# EAGLE design RCMx1 Rev_02 (EAGLE 6.5.0)
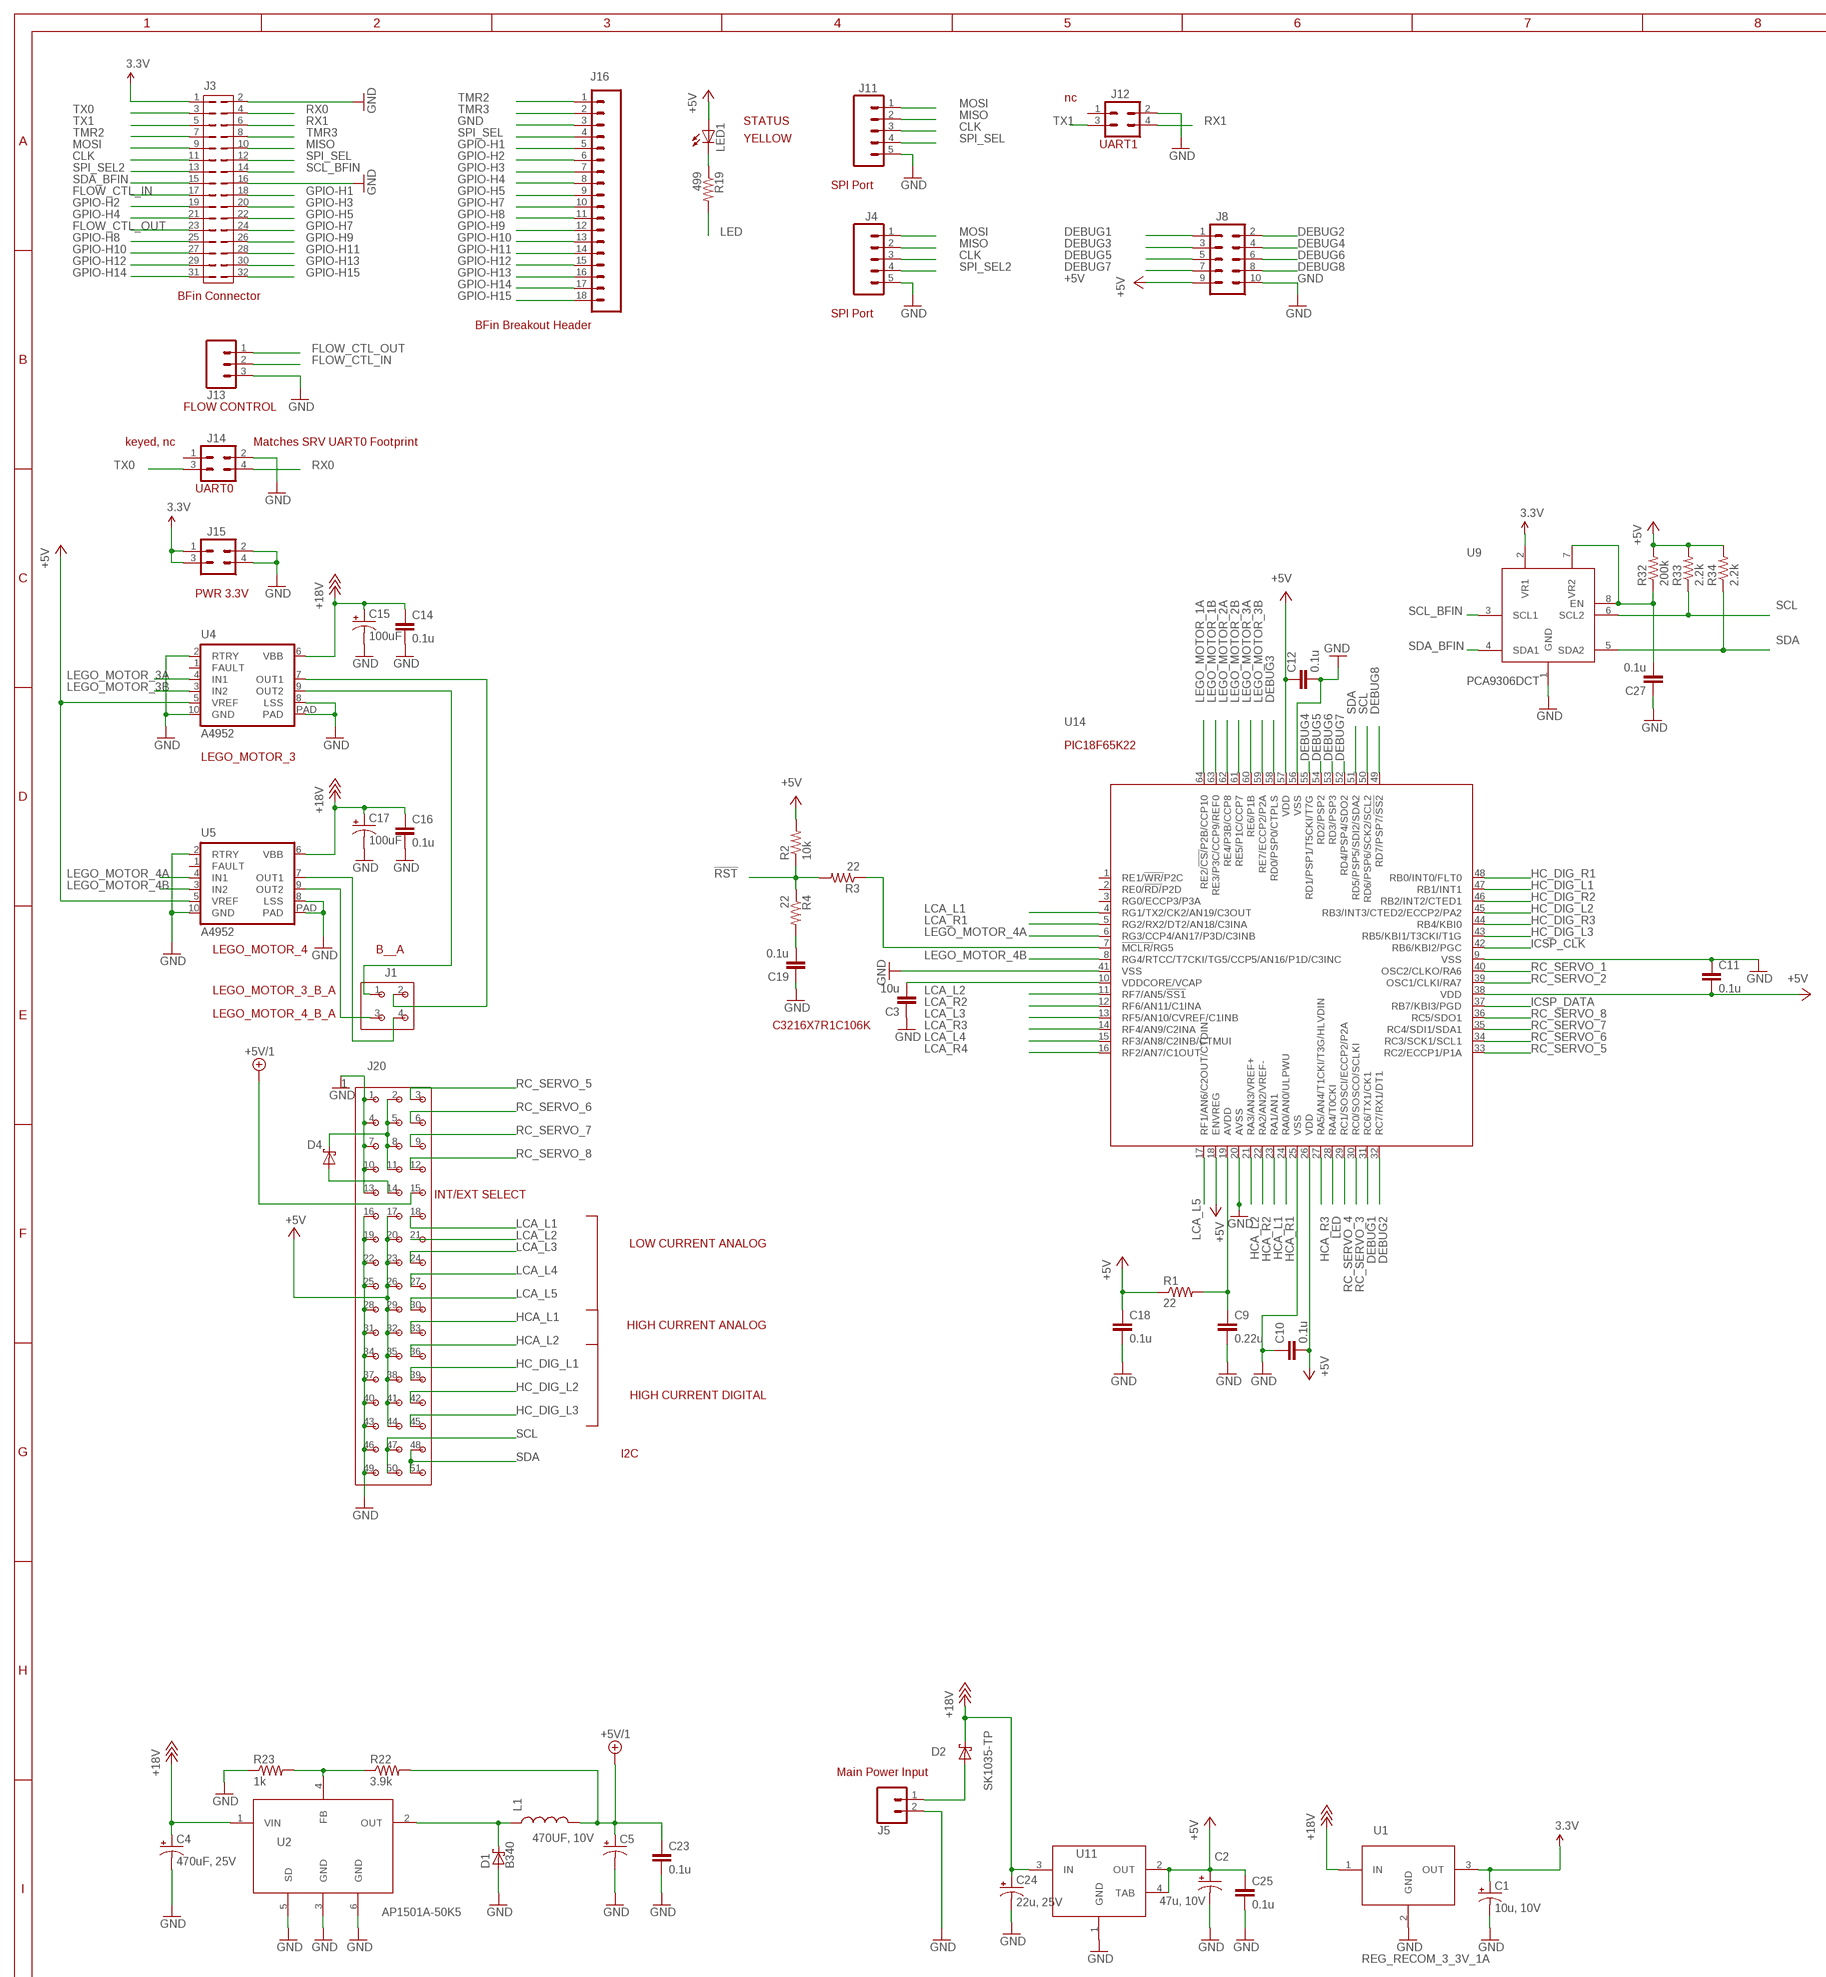
[diagram p0: schematic, sheet 1, part 1 of 2]
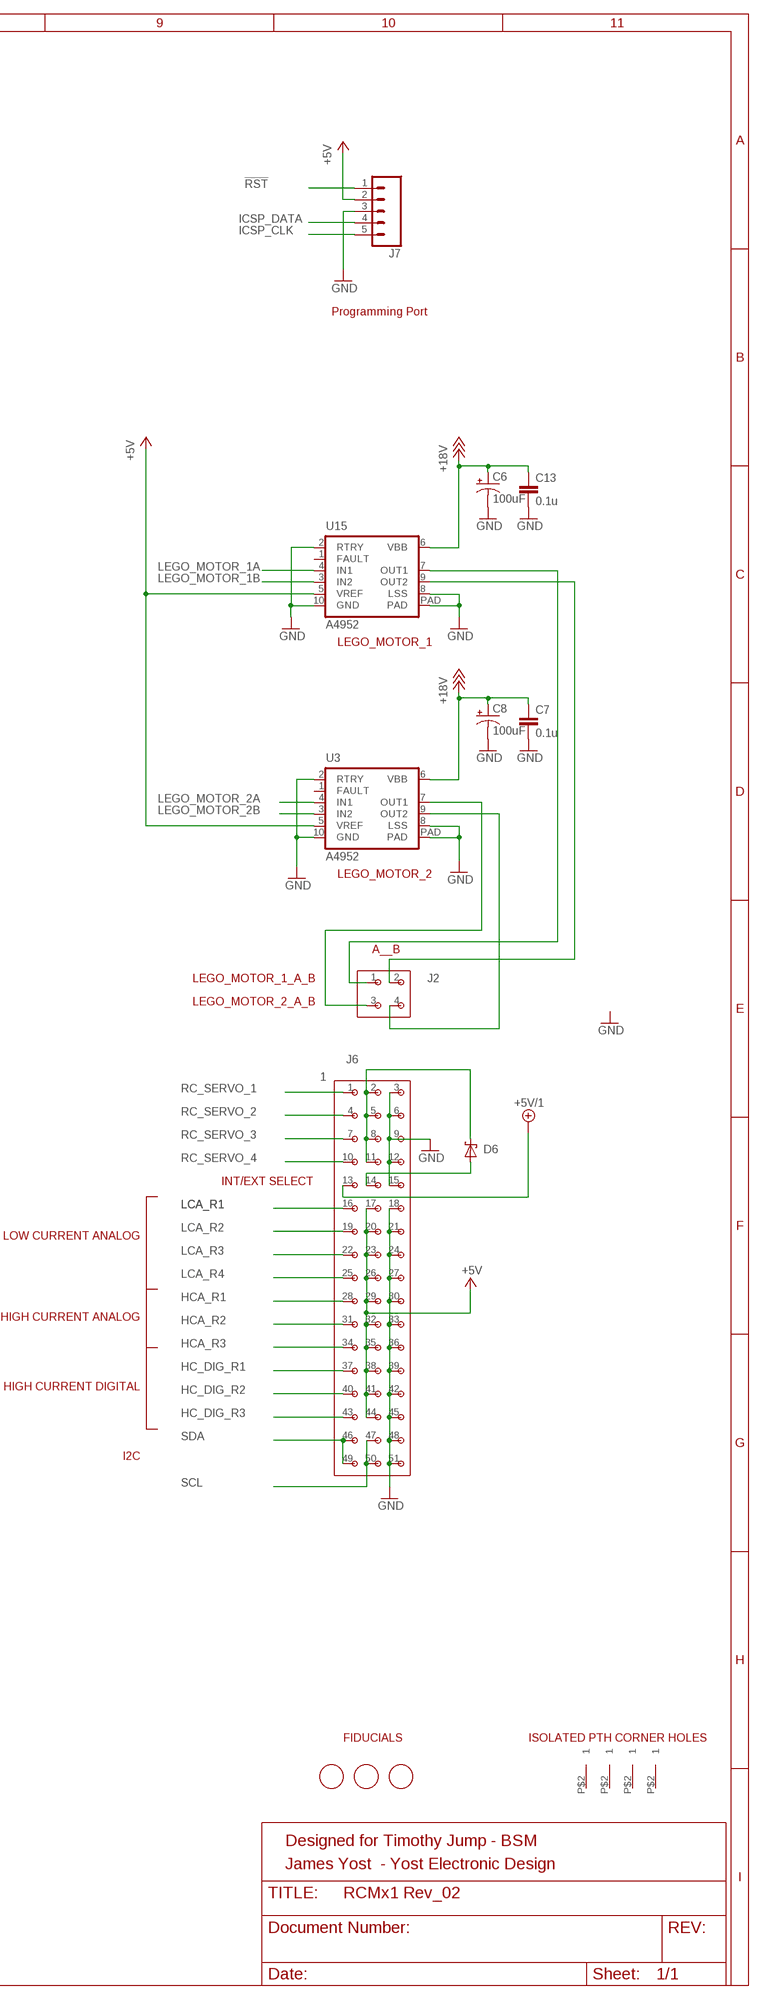
[diagram p1: schematic, sheet 1, part 2 of 2]

## Parts
C1  10u, 10V  CAP_POL1206  [EIA3216]
C2  47u, 10V  CAP_1210_POL  [CAP1210_POL]
C3  10u  CAP1206  [1206]
C4  470uF, 25V  CAP_POLG  [PANASONIC_G]
C5  470UF, 10V  CAP_ELT_PANASONIC_470UF  [PANASONIC_F]
C6  100uF  CAP_POLD  [PANASONIC_D]
C7  0.1u  CAP0805  [0805]
C8  100uF  CAP_POLD  [PANASONIC_D]
C9  0.22u  CAP0805  [0805]
C10  0.1u  CAP0805  [0805]
C11  0.1u  CAP0805  [0805]
C12  0.1u  CAP0805  [0805]
C13  0.1u  CAP0805  [0805]
C14  0.1u  CAP0805  [0805]
C15  100uF  CAP_POLD  [PANASONIC_D]
C16  0.1u  CAP0805  [0805]
C17  100uF  CAP_POLD  [PANASONIC_D]
C18  0.1u  CAP0805  [0805]
C19  0.1u  CAP0805  [0805]
C23  0.1u  CAP0805  [0805]
C24  22u, 25V  CAP_1210_POL  [CAP1210_POL]
C25  0.1u  CAP0805  [0805]
C27  0.1u  CAP0805  [0805]
D1  B340  [SMA_DO214AC]
D2  SK1035-TP  [DO214AB]
D4  SK1035-TP  [DO214AB]
D6  SK1035-TP  [DO214AB]
FID1  FIDUCIAL  [FIDUCIAL_1MM]
FID2  FIDUCIAL  [FIDUCIAL_1MM]
FID3  FIDUCIAL  [FIDUCIAL_1MM]
J1  CON_2X2_0_100  [CON_2X2_0_100]
J2  CON_2X2_0_100  [CON_2X2_0_100]
J3  CON_2X16_0_100  [CON_2X16_0_100]
J4  M05PTH  [1X05]
J5  M02NG  [1X02]
J6  CON_3X17_0_100  [CON_3X17_0_100]
J7  M05PTH  [1X05]
J8  M05X2PTH  [AVR_ICSP]
J11  M05PTH  [1X05]
J12  CON2X2  [CON2X2]
J13  M03PTH  [1X03]
J14  CON2X2  [CON2X2]
J15  CON2X2  [CON2X2]
J16  CON1X18  [CON1X18]
J20  CON_3X17_0_100  [CON_3X17_0_100]
L1  IND_47UH_COILTRONICS_2_95A  [IND_PADS_SMT]
LED1  LEDCHIP-LED0805  [CHIP-LED0805]
R1  22  RESISTOR  [0805]
R2  10k  RESISTOR  [0805]
R3  22  RESISTOR  [0805]
R4  22  RESISTOR  [0805]
R19  499  RESISTOR  [0805]
R22  3.9k  RESISTOR  [0805]
R23  1k  RESISTOR  [0805]
R32  200k  RESISTOR  [0805]
R33  2.2k  RESISTOR  [0805]
R34  2.2k  RESISTOR  [0805]
U1  REG_RECOM_3_3V_1A  [REG_RECOM_3_3V_1A]
U2  AP1501A-50K5  [TO263-5]
U3  A4952  [MSOP10_W_THERMAL_PAD]
U4  A4952  [MSOP10_W_THERMAL_PAD]
U5  A4952  [MSOP10_W_THERMAL_PAD]
U9  PCA9306DCT  [TEST08]
U11  TLV1117-5  [SOT223]
U14  MICRO_C_PIC18F65K22  [64PIN_TQFP_10X10X1MM]
U15  A4952  [MSOP10_W_THERMAL_PAD]
U$1  GNDPAD  [GNDPAD]
U$2  GNDPAD  [GNDPAD]
U$7  GNDPAD  [GNDPAD]
U$8  GNDPAD  [GNDPAD]

## Nets
3.3V: C1.A(+) J3.1 J15.1 J15.3 U1.3(OUT) U9.2(VR1)
!RST: J7.1 R2.1 R3.2 R4.1
+5V: C2.1(+) C10.2 C11.2 C12.1 C18.1 C25.1 J6.17 J6.20 J6.23 J6.26 J6.29 J6.32 J6.35 J6.38 J6.41 J6.44 J7.2 J8.9 J20.17 J20.20 J20.23 J20.26 J20.29 J20.32 J20.35 J20.38 J20.41 J20.44 LED1.A R1.1 R2.2 R32.2 R33.2 R34.2 U3.5(VREF) U4.5(VREF) U5.5(VREF) U11.2(OUT) U11.4(TAB) U14.18(ENVREG) U14.26(VDD) U14.38(VDD) U14.57(VDD) U15.5(VREF)
+5V/1: C5.+ C23.1 J6.13 J20.15 L1.2 R22.2
+18V: C4.+ C6.+ C7.1 C8.+ C13.1 C14.1 C15.+ C16.1 C17.+ C24.1(+) D2.1(C) U1.1(IN) U2.1(VIN) U3.6(VBB) U4.6(VBB) U5.6(VBB) U11.3(IN) U15.6(VBB)
CLK: J3.11 J4.3 J11.3
DEBUG1: J8.1 U14.31(RC6/TX1/CK1)
DEBUG2: J8.2 U14.32(RC7/RX1/DT1)
DEBUG3: J8.3 U14.58(RD0/PSP0/CTPLS)
DEBUG4: J8.4 U14.55(RD1/PSP1/T5CKI/T7G)
DEBUG5: J8.5 U14.54(RD2/PSP2)
DEBUG6: J8.6 U14.53(RD3/PSP3)
DEBUG7: J8.7 U14.52(RD4/PSP4/SDO2)
DEBUG8: J8.8 U14.49(RD7/PSP7/!SS2)
FLOW_CTL_IN: J3.17 J13.2
FLOW_CTL_OUT: J3.23 J13.1
GND: C1.C(-) C2.2(-) C3.1 C4.- C5.- C6.- C7.2 C8.- C9.2 C10.1 C11.1 C12.2 C13.2 C14.2 C15.- C16.2 C17.- C18.2 C19.1 C23.2 C24.2(-) C25.2 C27.1 D1.A J3.2 J3.16 J4.5 J5.2 J6.3 J6.6 J6.9 J6.12 J6.15 J6.18 J6.21 J6.24 J6.27 J6.30 J6.33 J6.36 J6.39 J6.42 J6.45 J6.48 J6.51 J7.3 J8.10 J11.5 J12.2 J13.3 J14.2 J15.2 J15.4 J16.3 J20.1 J20.4 J20.7 J20.10 J20.13 J20.16 J20.19 J20.22 J20.25 J20.28 J20.31 J20.34 J20.37 J20.40 J20.43 J20.46 J20.49 R23.1 U1.2(GND) U2.3(GND) U2.5(SD) U2.6(GND) U3.2(RTRY) U3.8(LSS) U3.10(GND) U3.PAD U4.2(RTRY) U4.8(LSS) U4.10(GND) U4.PAD U5.2(RTRY) U5.8(LSS) U5.10(GND) U5.PAD U9.1(GND) U11.1(GND) U14.9(VSS) U14.20(AVSS) U14.25(VSS) U14.41(VSS) U14.56(VSS) U15.2(RTRY) U15.8(LSS) U15.10(GND) U15.PAD
GPIO-H1: J3.18 J16.5
GPIO-H2: J3.19 J16.6
GPIO-H3: J3.20 J16.7
GPIO-H4: J3.21 J16.8
GPIO-H5: J3.22 J16.9
GPIO-H7: J3.24 J16.10
GPIO-H8: J3.25 J16.11
GPIO-H9: J3.26 J16.12
GPIO-H10: J3.27 J16.13
GPIO-H11: J3.28 J16.14
GPIO-H12: J3.29 J16.15
GPIO-H13: J3.30 J16.16
GPIO-H14: J3.31 J16.17
GPIO-H15: J3.32 J16.18
HC_DIG_L1: J20.39 U14.47(RB1/INT1)
HC_DIG_L2: J20.42 U14.45(RB3/INT3/CTED2/ECCP2/PA2)
HC_DIG_L3: J20.45 U14.43(RB5/KBI1/T3CKI/T1G)
HC_DIG_R1: J6.37 U14.48(RB0/INT0/FLT0)
HC_DIG_R2: J6.40 U14.46(RB2/INT2/CTED1)
HC_DIG_R3: J6.43 U14.44(RB4/KBI0)
HCA_L1: J20.33 U14.23(RA1/AN1)
HCA_L2: J20.36 U14.21(RA3/AN3/VREF+)
HCA_R1: J6.28 U14.24(RA0/AN0/ULPWU)
HCA_R2: J6.31 U14.22(RA2/AN2/VREF-)
HCA_R3: J6.34 U14.27(RA5/AN4/T1CKI/T3G/HLVDIN)
ICSP_CLK: J7.5 U14.42(RB6/KBI2/PGC)
ICSP_DATA: J7.4 U14.37(RB7/KBI3/PGD)
LCA_L1: J20.18 U14.4(RG1/TX2/CK2/AN19/C3OUT)
LCA_L2: J20.21 U14.11(RF7/AN5/!SS1)
LCA_L3: J20.24 U14.13(RF5/AN10/CVREF/C1INB)
LCA_L4: J20.27 U14.15(RF3/AN8/C2INB/CTMUI)
LCA_L5: J20.30 U14.17(RF1/AN6/C2OUT/CTDIN)
LCA_R1: J6.16 U14.5(RG2/RX2/DT2/AN18/C3INA)
LCA_R2: J6.19 U14.12(RF6/AN11/C1INA)
LCA_R3: J6.22 U14.14(RF4/AN9/C2INA)
LCA_R4: J6.25 U14.16(RF2/AN7/C1OUT)
LED: R19.2 U14.28(RA4/T0CKI)
LEGO_1A: J2.1 U15.7(OUT1)
LEGO_1B: J2.2 U15.9(OUT2)
LEGO_2A: J2.3 U3.7(OUT1)
LEGO_2B: J2.4 U3.9(OUT2)
LEGO_4A: J1.4 U5.7(OUT1)
LEGO_4B: J1.3 U5.9(OUT2)
LEGO_MOTOR_1A: U14.64(RE2/!CS/!P2B/CCP10) U15.4(IN1)
LEGO_MOTOR_1B: U14.63(RE3/P3C/CCP9/REF0) U15.3(IN2)
LEGO_MOTOR_2A: U3.4(IN1) U14.62(RE4/P3B/CCP8)
LEGO_MOTOR_2B: U3.3(IN2) U14.61(RE5/P1C/CCP7)
LEGO_MOTOR_3A: U4.4(IN1) U14.60(RE6/P1B)
LEGO_MOTOR_3B: U4.3(IN2) U14.59(RE7/ECCP2/P2A)
LEGO_MOTOR_4A: U5.4(IN1) U14.6(RG3/CCP4/AN17/P3D/C3INB)
LEGO_MOTOR_4B: U5.3(IN2) U14.8(RG4/RTCC/T7CKI/TG5/CCP5/AN16/P1D/C3INC)
MISO: J3.10 J4.2 J11.2
MOSI: J3.9 J4.1 J11.1
N$1: D1.C L1.1 U2.2(OUT)
N$3: R3.1 U14.7(!MCLR/!RG5)
N$5: D6.2(A) J6.14
N$6: D6.1(C) J6.2 J6.5 J6.8 J6.11
N$9: C19.2 R4.2
N$12: D4.1(C) J20.2 J20.5 J20.8 J20.11
N$18: C9.1 R1.2 U14.19(AVDD)
N$26: D2.2(A) J5.1
N$31: J1.2 U4.7(OUT1)
N$32: J1.1 U4.9(OUT2)
N$34: R22.1 R23.2 U2.4(FB)
N$37: C3.2 U14.10(VDDCORE/VCAP)
N$39: D4.2(A) J20.14
N$40: C27.2 R32.1 U9.7(VR2) U9.8(EN)
N$42: LED1.C R19.1
RC_SERVO_1: J6.1 U14.40(OSC2/CLKO/RA6)
RC_SERVO_2: J6.4 U14.39(OSC1/CLKI/RA7)
RC_SERVO_3: J6.7 U14.30(RC0/SOSCO/SCLKI)
RC_SERVO_4: J6.10 U14.29(RC1/SOSCI/ECCP2/P2A)
RC_SERVO_5: J20.3 U14.33(RC2/ECCP1/P1A)
RC_SERVO_6: J20.6 U14.34(RC3/SCK1/SCL1)
RC_SERVO_7: J20.9 U14.35(RC4/SDI1/SDA1)
RC_SERVO_8: J20.12 U14.36(RC5/SDO1)
RX0: J3.4 J14.4
RX1: J3.6 J12.4
SCL: J6.47 J6.50 J20.47 J20.50 R33.1 U9.6(SCL2) U14.50(RD6/PSP6/SCK2/SCL2)
SCL_BFIN: J3.14 U9.3(SCL1)
SDA: J6.46 J6.49 J20.48 J20.51 R34.1 U9.5(SDA2) U14.51(RD5/PSP5/SDI2/SDA2)
SDA_BFIN: J3.15 U9.4(SDA1)
SPI_SEL: J3.12 J11.4 J16.4
SPI_SEL2: J3.13 J4.4
TMR2: J3.7 J16.1
TMR3: J3.8 J16.2
TX0: J3.3 J14.3
TX1: J3.5 J12.3
Unconnected: J12.1 J14.1 U3.1(FAULT) U4.1(FAULT) U5.1(FAULT) U14.1(RE1/!WR/!P2C) U14.2(RE0/!RD/!P2D) U14.3(RG0/ECCP3/P3A) U15.1(FAULT) U$1.P$2 U$2.P$2 U$7.P$2 U$8.P$2

## Notes on the sheet
- nc
- STATUS
- YELLOW
- UART1
- SPI Port
- BFin Connector
- SPI Port | Programming Port
- BFin Breakout Header
- FLOW CONTROL
- keyed, nc | Matches SRV UART0 Footprint
- UART0
- PWR 3.3V
- LEGO_MOTOR_1
- PIC18F65K22
- LEGO_MOTOR_3
- LEGO_MOTOR_2
- LEGO_MOTOR_4 | B__A
- A__B
- LEGO_MOTOR_1_A_B
- LEGO_MOTOR_3_B_A
- LEGO_MOTOR_2_A_B
- LEGO_MOTOR_4_B_A
- C3216X7R1C106K
- INT/EXT SELECT
- INT/EXT SELECT
- LOW CURRENT ANALOG | LOW CURRENT ANALOG
- HIGH CURRENT ANALOG | HIGH CURRENT ANALOG
- HIGH CURRENT DIGITAL | HIGH CURRENT DIGITAL
- I2C
- I2C
- FIDUCIALS | ISOLATED PTH CORNER HOLES
- Main Power Input
- Designed for Timothy Jump - BSM
- James Yost  - Yost Electronic Design

## Library data of the parts
C1 C4 = SparkFun:CAP_POL: Capacitor Polarized These are standard SMD and PTH capacitors. Normally 10uF, 47uF, and 100uF in electrolytic and tantalum varieties. Always verify the external diameter of the through hole cap, it varies with capacity, voltage, and manufacturer. The EIA devices should be standard.
C2 C24 = JLY Parts:CAP_1210_POL: Polarized Capacitor, 1210 Size, SMT
C3 = SparkFun-Passives:CAP: Capacitor Standard 0603 ceramic capacitor, and 0.1" leaded capacitor.
C5 = JLY Parts:CAP_ELT_PANASONIC_470UF: 470UF 10V ELECT, Panasonic - ECG, EEE-FP1A471AP, Digikey PCE4526CT-ND
C6 C8 C15 C17 = SparkFun-Passives:CAP_POL: Capacitor Polarized These are standard SMD and PTH capacitors. Normally 10uF, 47uF, and 100uF in electrolytic and tantalum varieties. Always verify the external diameter of the through hole cap, it varies with capacity, voltage, and manufacturer. The EIA devices should be standard.
C7 C9-C14 C16 C18 C19 C23 C25 C27 = SparkFun:CAP: Capacitor Standard 0603 ceramic capacitor, and 0.1" leaded capacitor.
D1 = JLY Parts:B340
D2 D4 D6 = JLY Parts:SK1035-TP: DIODE SCHOTTKY 10A 35V DO-214AB, Micro Commercial Co, Digikey SK1035-TPCT-ND
FID1-FID3 = adafruit:FIDUCIAL: For use by pick and place machines to calibrate the vision/machine, 1mm By microbuilder.eu
J1 J2 = JLY Parts_V_5_11:CON_2X2_0_100
J3 = JLY Parts:CON_2X16_0_100
J4 J11 = SparkFun:M05: Header 5 Standard 5-pin 0.1" header. Use with straight break away headers (SKU : PRT-00116), right angle break away headers (PRT-00553), swiss pins (PRT-00743), machine pins (PRT-00117), and female headers (PRT-00115). Molex polarized connector foot print use with SKU : PRT-08230 with associated crimp pins and housings.
J5 = SparkFun:M02NG
J6 J20 = JLY Parts_V_5_11:CON_3X17_0_100
J7 = SparkFun-Connectors:M05: Header 5 Standard 5-pin 0.1" header. Use with straight break away headers (SKU : PRT-00116), right angle break away headers (PRT-00553), swiss pins (PRT-00743), machine pins (PRT-00117), and female headers (PRT-00115). Molex polarized connector foot print use with SKU : PRT-08230 with associated crimp pins and housings.
J8 = SparkFun-Connectors:M05X2: Header 5x2 Standard 10-pin dual row 0.1" header. Commonly used with AVR-ISP. Use with Spark Fun Electronics SKU: PRT-00778
J12 J14 J15 = JLY Parts:CON2X2
J13 = SparkFun:M03: Header 3 Standard 3-pin 0.1" header. Use with straight break away headers (SKU : PRT-00116), right angle break away headers (PRT-00553), swiss pins (PRT-00743), machine pins (PRT-00117), and female headers (PRT-00115). Molex polarized connector foot print use with SKU : PRT-08232 with associated crimp pins and housings.
J16 = JLY Parts:CON1X18: Connector 1x18 with 0.1" spacing
L1 = JLY Parts:IND_47UH_COILTRONICS_2_95A: 47UH SMD DR Coiltronics, DR127-470-R, Digikey 513-1050-6-ND, INDUCTOR SHIELD
LED1 = led:LED: LED OSRAM: - CHIPLED LG R971, LG N971, LY N971, LG Q971, LY Q971, LO R971, LY R971 LH N974, LH R974 LS Q976, LO Q976, LY Q976 LO Q996 - Hyper CHIPLED LW Q18S LB Q993, LB Q99A, LB R99A - SideLED LS A670, LO A670, LY A670, LG A670, LP A670 LB A673, LV A673, LT A673, LW A673 LH A674 LY A675 LS A676, LA A676, LO A676, LY A676, LW A676 LS A679, LY A679, LG A679 - Hyper Micro SIDELED® LS Y876, LA Y876, LO Y876, LY Y876 LT Y87S - SmartLED LW L88C, LW L88S LB L89C, LB L89S, LG L890 LS L89K, LO L89K, LY L89K LS L896, LA L896, LO L896, LY L896 - TOPLED LS T670, LO T670, LY T670, LG T670, LP T670 LSG T670, LSP T670, LSY T670, LOP T670, LYG T670 LG T671, LOG T671, LSG T671 LB T673, LV T673, LT T673, LW T673 LH T674 LS T676, LA T676, LO T676, LY T676, LB T676, LH T676, LSB T676, LW T676 LB T67C, LV T67C, LT T67C, LS T67K, LO T67K, LY T67K, LW E67C LS E67B, LA E67B, LO E67B, LY E67B, LB E67C, LV E67C, LT E67C LW T67C LS T679, LY T679, LG T679 LS T770, LO T770, LY T770, LG T770, LP T770 LB T773, LV T773, LT T773, LW T773 LH T774 LS E675, LA E675, LY E675, LS T675 LS T776, LA T776, LO T776, LY T776, LB T776 LHGB T686 LT T68C, LB T68C - Hyper Mini TOPLED® LB M676 - Mini TOPLED Santana® LG M470 LS M47K, LO M47K, LY M47K Source: http://www.osram.convergy.de LUXEON: - LUMILED® LXK2-PW12-R00, LXK2-PW12-S00, LXK2-PW14-U00, LXK2-PW14-V00 LXK2-PM12-R00, LXK2-PM12-S00, LXK2-PM14-U00 LXK2-PE12-Q00, LXK2-PE12-R00, LXK2-PE12-S00, LXK2-PE14-T00, LXK2-PE14-U00 LXK2-PB12-K00, LXK2-PB12-L00, LXK2-PB12-M00, LXK2-PB14-N00, LXK2-PB14-P00, LXK2-PB14-Q00 LXK2-PR12-L00, LXK2-PR12-M00, LXK2-PR14-Q00, LXK2-PR14-R00 LXK2-PD12-Q00, LXK2-PD12-R00, LXK2-PD12-S00 LXK2-PH12-R00, LXK2-PH12-S00 LXK2-PL12-P00, LXK2-PL12-Q00, LXK2-PL12-R00 Source: www.luxeon.com KINGBRIGHT: KA-3528ASYC Source: www.kingbright.com
R1-R4 R19 R22 R23 R32-R34 = SparkFun:RESISTOR: Resistor Basic schematic elements and footprints for 0603, 1206, and PTH 1/10th watt (small) resistors.
U1 = JLY Parts:REG_RECOM_3_3V_1A: REG DC/DC 1A 3.3V OUT SIP VERT Innoline R-78-1.0 Recom Power Inc, Digikey 945-1036-ND
U2 = JLY Parts:AP1501A-50K5: Buck Regulator 5V, Diodes Inc, AP1501A-50K5L-1, Digikey AP1501A-50K5LDICT-ND, DC-DC 5A 5.0V TO263-5L
U3-U5 U15 = JLY_Parts:A4952: PWM Motor Driver, A4952, Allegro A4952ELYTR-T, Digikey 620-1451-1-ND, MSOP10 pkg
U9 = JLY Parts:PCA9306DCT
U11 = JLY Parts:TLV1117-5
U14 = JLY_Parts:MICRO_C_PIC18F65K22: Micro_C, PIC18F65K22, 64PIN_TQFP
U$1 U$2 U$7 U$8 = JLY Parts:GNDPAD: Pad, round, 0.125 ID, 0.250 OD

## Board
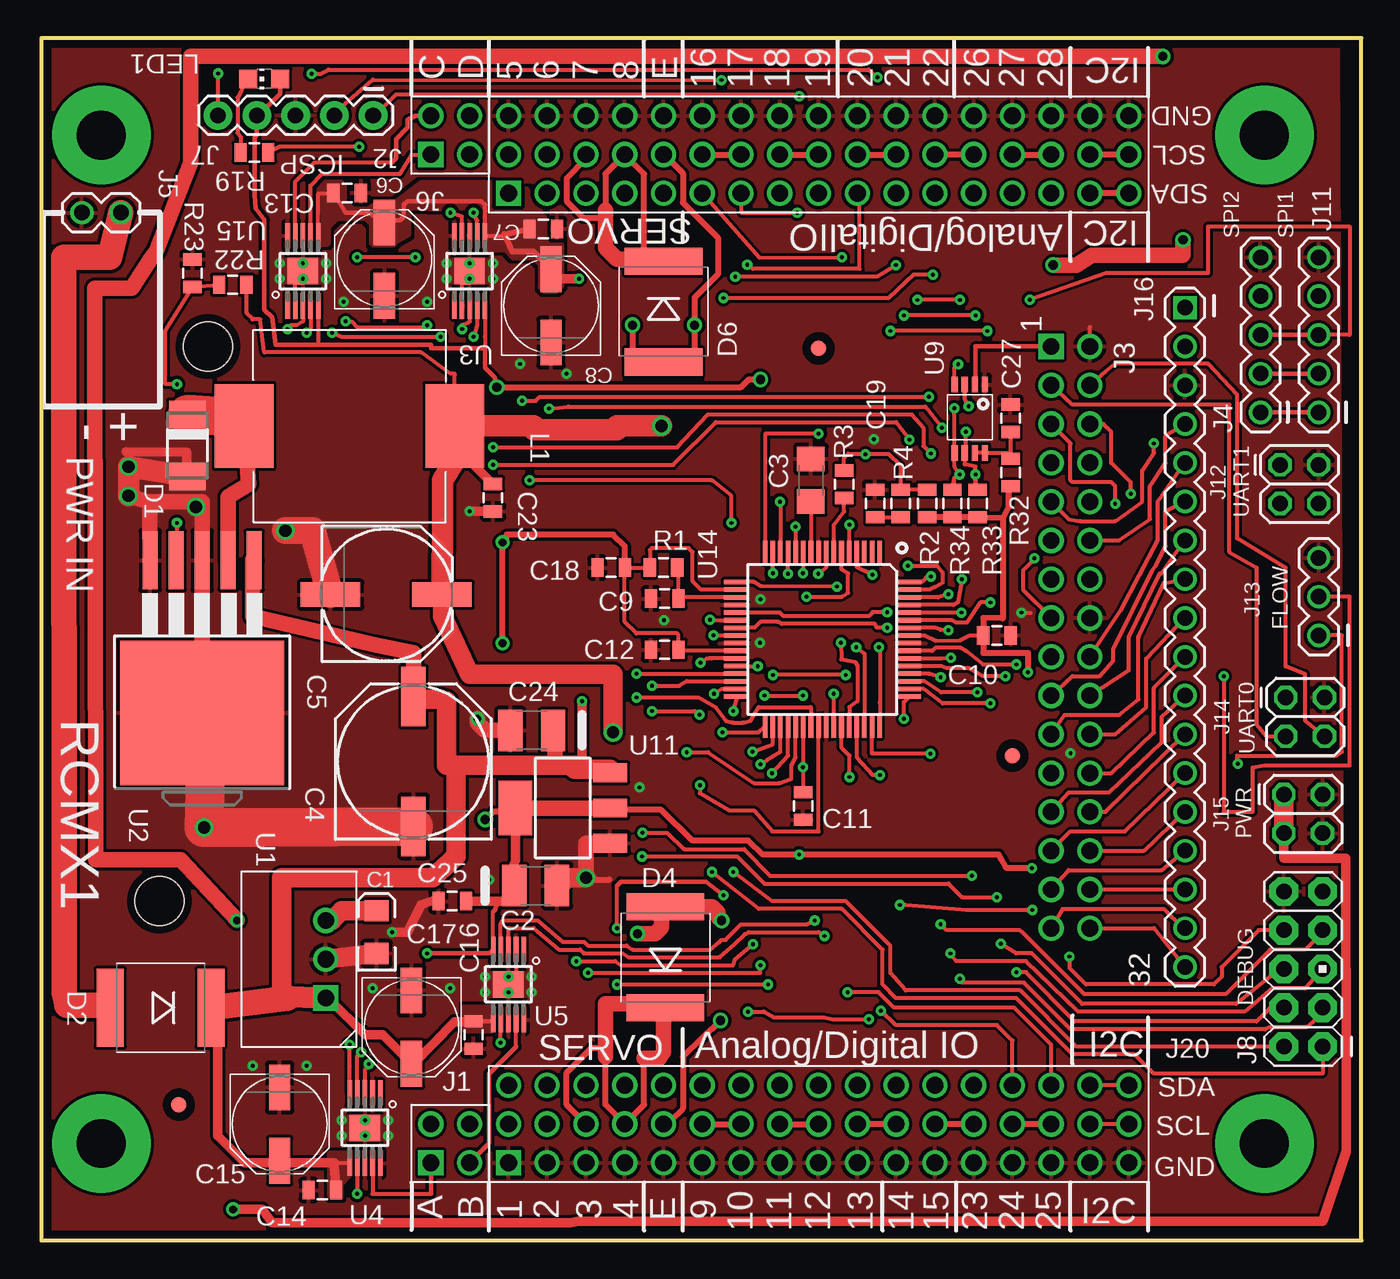
[diagram p2: board, top side]
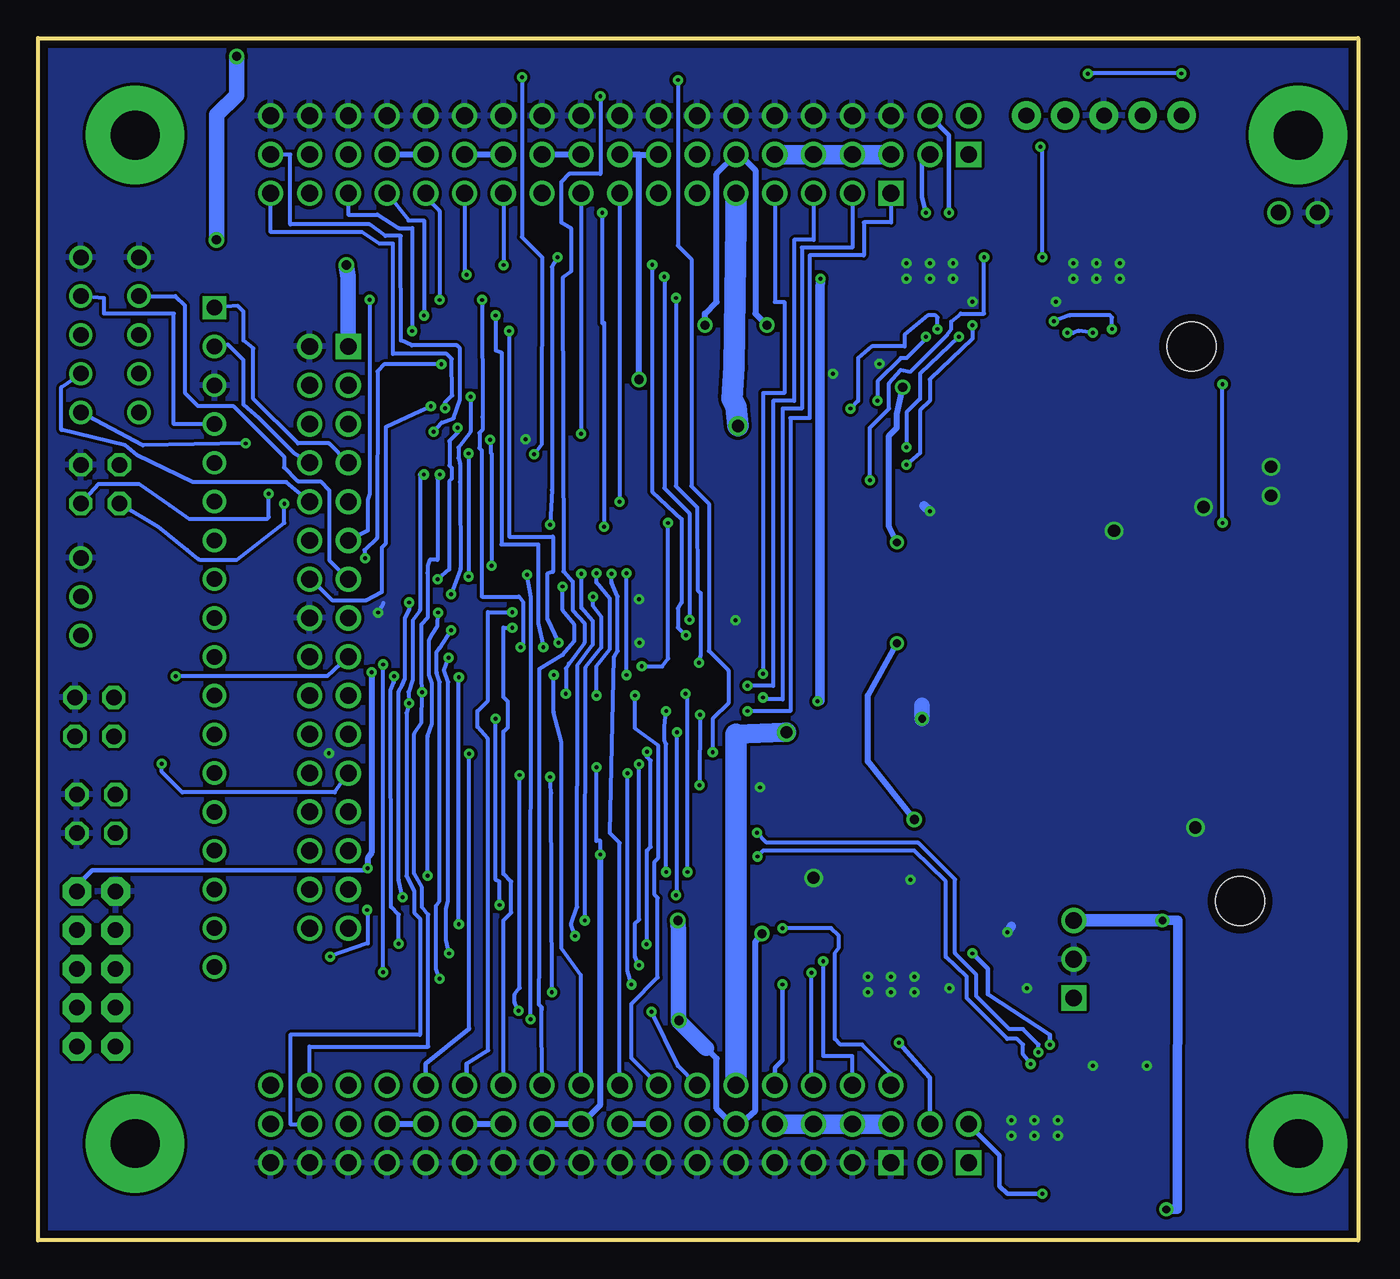
[diagram p3: board, bottom side, seen from below]

Size 86.49 x 78.74 mm. Coordinates in mm from the lower left corner, seen from the top.
Outline: 86.49,0 86.49,78.74 0,78.74 0,0 86.49,0
Copper layers (1*16): Top 0.035mm / dielectric 1.5mm / Bottom 0.035mm
Design rules "default": minimum track width 10mil, minimum drill 10mil, track to track 8mil, track to pad 8mil, pad to pad 3mil, via to via 8mil, smd to smd 3mil, copper to edge 20mil, drill to drill 8mil, minimum pad ring 10mil, minimum via ring 8mil, stop-mask expansion 4mil, vias tented up to drill 0mil, thermal gap 10mil
Holes 3.2 mm at 7.75,22.23 10.92,58.55

### Footprints (pad centres in the part's own frame; a part is rotated, then mirrored left to right if it is on the bottom)
EIA3216 = smd 1.4 x 1.6: A 1.4,0; C -1.4,0
CAP1210_POL = smd 1.6 x 2.7: 1 -1.4,0; 2 1.4,0
1206 = smd 1.6 x 1.8: 1 -1.4,0; 2 1.4,0
PANASONIC_G = smd 3.9 x 1.6: + 4.25,0; - -4.25,0
PANASONIC_F = smd 3.9 x 1.6: + 3.65,0; - -3.65,0
PANASONIC_D = smd 3 x 1.4: + 2.4,0; - -2.4,0
0805 = smd 0.8 x 1.2: 1 -0.9,0; 2 0.9,0
SMA_DO214AC = smd 1.8 x 2.4: A 2.025,0; C -2.025,0
DO214AB = smd 1.778 x 5.08: 1 -3.302,0; 2 3.302,0
FIDUCIAL_1MM = smd 1 x 1: 1 0,0
CON_2X2_0_100 = drill 1.1 square: 1 -1.27,1.27 | drill 1.1: 2 1.27,1.27; 3 -1.27,-1.27; 4 1.27,-1.27
CON_2X16_0_100 = drill 1.1 square: 1 -1.27,20.32 | drill 1.1: 2 1.27,20.32; 3 -1.27,17.78; 4 1.27,17.78; 5 -1.27,15.24; 6 1.27,15.24; 7 -1.27,12.7; 8 1.27,12.7; 9 -1.27,10.16; 10 1.27,10.16; 11 -1.27,7.62; 12 1.27,7.62; 13 -1.27,5.08; 14 1.27,5.08; 15 -1.27,2.54; 16 1.27,2.54; 17 -1.27,0; 18 1.27,0; 19 -1.27,-2.54; 20 1.27,-2.54; 21 -1.27,-5.08; 22 1.27,-5.08; 23 -1.27,-7.62; 24 1.27,-7.62; 25 -1.27,-10.16; 26 1.27,-10.16; 27 -1.27,-12.7; 28 1.27,-12.7; 29 -1.27,-15.24; 30 1.27,-15.24; 31 -1.27,-17.78; 32 1.27,-17.78
1X05 = drill 1.016: 1 0,0; 2 2.54,0; 3 5.08,0; 4 7.62,0; 5 10.16,0
1X02 = drill 1.016: 1 0,0; 2 2.54,0
CON_3X17_0_100 = drill 1.1 square: 1 -2.54,20.32 | drill 1.1: 2 0,20.32; 3 2.54,20.32; 4 -2.54,17.78; 5 0,17.78; 6 2.54,17.78; 7 -2.54,15.24; 8 0,15.24; 9 2.54,15.24; 10 -2.54,12.7; 11 0,12.7; 12 2.54,12.7; 13 -2.54,10.16; 14 0,10.16; 15 2.54,10.16; 16 -2.54,7.62; 17 0,7.62; 18 2.54,7.62; 19 -2.54,5.08; 20 0,5.08; 21 2.54,5.08; 22 -2.54,2.54; 23 0,2.54; 24 2.54,2.54; 25 -2.54,0; 26 0,0; 27 2.54,0; 28 -2.54,-2.54; 29 0,-2.54; 30 2.54,-2.54; 31 -2.54,-5.08; 32 0,-5.08; 33 2.54,-5.08; 34 -2.54,-7.62; 35 0,-7.62; 36 2.54,-7.62; 37 -2.54,-10.16; 38 0,-10.16; 39 2.54,-10.16; 40 -2.54,-12.7; 41 0,-12.7; 42 2.54,-12.7; 43 -2.54,-15.24; 44 0,-15.24; 45 2.54,-15.24; 46 -2.54,-17.78; 47 0,-17.78; 48 2.54,-17.78; 49 -2.54,-20.32; 50 0,-20.32; 51 2.54,-20.32
1X05' = drill 1.016 pad 1.88: 1 0,0; 2 2.54,0; 3 5.08,0; 4 7.62,0; 5 10.16,0
AVR_ICSP = drill 1.016 pad 1.88 octagon: 1 -1.27,5.08; 2 1.27,5.08; 3 -1.27,2.54; 4 1.27,2.54; 5 -1.27,0; 6 1.27,0; 7 -1.27,-2.54; 8 1.27,-2.54; 9 -1.27,-5.08; 10 1.27,-5.08
CON2X2 = drill 1.016 octagon: 1 -1.27,-1.27; 2 -1.27,1.27; 3 1.27,-1.27; 4 1.27,1.27
1X03 = drill 1.016: 1 0,0; 2 2.54,0; 3 5.08,0
CON1X18 = drill 1.016 square: 1 -20.32,0 | drill 1.016: 2 -17.78,0; 3 -15.24,0; 4 -12.7,0; 5 -10.16,0; 6 -7.62,0; 7 -5.08,0; 8 -2.54,0; 9 0,0; 10 2.54,0; 11 5.08,0; 12 7.62,0; 13 10.16,0; 14 12.7,0; 15 15.24,0; 16 17.78,0; 17 20.32,0; 18 22.86,0
IND_PADS_SMT = smd 3.85 x 5.5: 1 -6.9,0; 2 6.9,0
CHIP-LED0805 = smd 1.2 x 1.2: A 0,-1.05; C 0,1.05
REG_RECOM_3_3V_1A = drill 1.1 square: 1 -2.54,-1.75 | drill 1.1: 2 0,-1.75; 3 2.54,-1.75
TO263-5 = smd 1 x 3.8: 1 -3.4,-10; 2 -1.7,-10; 3 0,-10; 4 1.7,-10; 5 3.4,-10 | smd 10.75 x 9.45: 6 0,0
MSOP10_W_THERMAL_PAD = smd 0.3 x 1.65: 1 -1,-2.3; 2 -0.5,-2.3; 3 0,-2.3; 4 0.5,-2.3; 5 1,-2.3; 6 1,2.3; 7 0.5,2.3; 8 0,2.3; 9 -0.5,2.3; 10 -1,2.3 | smd 1.98 x 1.73: PAD 0,0
TEST08 = smd 0.406 x 1.016: 1 -0.991,-1.956; 2 -0.33,-1.956; 3 0.33,-1.956; 4 0.991,-1.956; 5 0.991,2.515; 6 0.33,2.515; 7 -0.33,2.515; 8 -0.991,2.515
SOT223 = smd 1.219 x 2.235: 1 -2.311,-3.099; 2 0,-3.099; 3 2.311,-3.099 | smd 3.6 x 2.2: 4 0,3.099
64PIN_TQFP_10X10X1MM = smd 1.5 x 0.3: 1 -5.7,4; 2 -5.7,3.5; 3 -5.7,3; 4 -5.7,2.5; 5 -5.7,2; 6 -5.7,1.5; 7 -5.7,1; 8 -5.7,0.5; 9 -5.7,0; 10 -5.7,-0.5; 11 -5.7,-1; 12 -5.7,-1.5; 13 -5.7,-2; 14 -5.7,-2.5; 15 -5.7,-3; 16 -5.7,-3.5; 33 5.7,-3.5; 34 5.7,-3; 35 5.7,-2.5; 36 5.7,-2; 37 5.7,-1.5; 38 5.7,-1; 39 5.7,-0.5; 40 5.7,0; 41 5.7,0.5; 42 5.7,1; 43 5.7,1.5; 44 5.7,2; 45 5.7,2.5; 46 5.7,3; 47 5.7,3.5; 48 5.7,4 | smd 0.3 x 1.5: 17 -3.75,-5.45; 18 -3.25,-5.45; 19 -2.75,-5.45; 20 -2.25,-5.45; 21 -1.75,-5.45; 22 -1.25,-5.45; 23 -0.75,-5.45; 24 -0.25,-5.45; 25 0.25,-5.45; 26 0.75,-5.45; 27 1.25,-5.45; 28 1.75,-5.45; 29 2.25,-5.45; 30 2.75,-5.45; 31 3.25,-5.45; 32 3.75,-5.45; 49 3.75,5.95; 50 3.25,5.95; 51 2.75,5.95; 52 2.25,5.95; 53 1.75,5.95; 54 1.25,5.95; 55 0.75,5.95; 56 0.25,5.95; 57 -0.25,5.95; 58 -0.75,5.95; 59 -1.25,5.95; 60 -1.75,5.95; 61 -2.25,5.95; 62 -2.75,5.95; 63 -3.25,5.95; 64 -3.75,5.95
GNDPAD = drill 3.2 pad 6.452: P$2 0,0

### Placement (x,y rotation side)
C1  21.97,20.19 90 top
C2  32.39,23.24 0 top
C3  50.42,49.78 270 top
C4  24.38,31.37 90 top
C5  22.61,42.29 0 top
C6  22.48,64.26 90 top
C7  32.89,66.24 0 top
C8  33.4,61.21 90 top
C9  40.84,42.04 180 top
C10  62.61,39.62 180 top
C11  49.91,28.45 90 top
C12  40.84,38.68 180 top
C13  20.04,68.61 0 top
C14  18.41,3.3 180 top
C15  15.62,7.62 270 top
C16  28.32,13.46 270 top
C17  24.26,13.97 270 top
C18  37.34,44.07 180 top
C19  54.64,48.26 270 top
C23  29.59,48.64 270 top
C24  32.13,33.4 180 top
C25  26.92,22.23 180 top
C27  63.5,53.85 270 top
D1  9.58,52.07 270 top
D2  7.82,15.24 180 top
D4  40.89,18.54 90 top
D6  40.77,60.83 270 top
FID1  9.02,8.89 0 top
FID2  50.93,58.42 0 top
FID3  63.63,31.75 0 top
J1  26.8,6.35 90 top
J2  26.8,72.39 90 top
J3  67.44,38.23 0 top
J4  79.88,54.23 90 top
J5  5.21,67.31 180 top
J6  50.93,71.12 90 top
J7  [1X05']  11.58,73.69 0 top
J8  82.68,17.78 180 top
J11  83.69,54.23 90 top
J12  82.42,49.53 270 top
J13  83.69,39.62 90 top
J14  82.8,34.29 270 top
J15  82.68,27.94 270 top
J16  74.93,40.77 270 top
J20  50.93,7.62 90 top
L1  20.19,53.34 0 top
LED1  14.61,76.07 90 top
R1  40.77,44.07 0 top
R2  58.04,48.26 270 top
R3  52.6,49.53 90 top
R4  56.31,48.26 270 top
R19  13.97,71.25 0 top
R22  12.55,62.59 0 top
R23  9.91,63.35 270 top
R32  63.5,50.29 270 top
R33  61.34,48.26 270 top
R34  59.69,48.26 270 top
U1  16.89,18.41 90 top
U2  10.54,34.54 180 top
U3  28.07,63.5 0 top
U4  21.21,7.37 180 top
U5  30.61,16.76 180 top
U9  60.83,54.1 180 top
U11  34.16,28.32 90 top
U14  50.93,39.37 270 top
U15  17.14,63.5 0 top
U$1  3.94,6.35 0 top
U$2  3.94,72.39 0 top
U$7  80.14,72.39 90 top
U$8  80.14,6.35 90 top

### Tracks (layer width: path | path; a pad name or v marks a point on that pad's centre or on a via)
3.3V  (via drill 0.5, 0.6)
  Top 0.305: U9.2 61.21,56.06 61.21,58.55 J3.1
  Top 0.406: 9.8,70.52 9.8,70.59
  Top 0.61: v12.57,2.03 14.48,2.03 15.11,1.14 34.67,1.14 35.18,1.27 83.95,1.27 85.5,5.84 85.5,10.67 85.47,25.02 81.41,25.02 J15.3
  Top 1.016: v12.83,20.95 9.12,24.92 3.56,24.92 3.56,28.32 3.56,28.35 3.56,29.46 3.53,40.03 3.5,62.36 5.92,62.36 7.24,64.39 7.54,64.77 9.8,70.59 9.78,70.59 9.78,77.55 73,77.55 v73.48,77.55 | v74.8,65.53 74.8,64.52 68.83,64.52 67.82,63.88 v66.29,63.88
  Top 1.27: C1.A 19.68,21.59 19.05,20.95 U1.3 | J15.3 J15.1
  Bottom 0.61: v12.57,2.03 11.84,2.03 11.84,4.7 11.81,20.95 v12.83,20.95
  Bottom 0.813: v12.83,20.95 U1.3
  Bottom 1.016: v73.48,77.55 73.48,75.01 74.8,73.74 v74.8,65.53 | v66.29,63.88 66.17,63.12 J3.1
!RST  (via drill 0.25)
  Top 0.254: J7.1 v11.58,76.43 | v54.79,76.17 54.2,76.68 18.82,76.68 18.31,76.4 v17.7,76.4 | R2.1 R4.1 56.31,50.72 55.55,51.49 v54,51.49 53.95,51.54 52.88,51.54 52.6,51.26 R3.2
  Bottom 0.254: v54.79,76.17 54.79,65.71 53.47,64.39 53.49,52.7 53.49,52.15 v54,51.49 | v11.58,76.43 17.37,76.43 v17.7,76.4
+5V  (via drill 0.25, 0.5, 0.5 pad 0.61, 0.6, 0.61)
  Top 0.254: U11.4 30.61,28.07 | 29.08,61.18 U3.5 29.07,59.2 29.08,58.42 | U4.5 20.21,11.41 v20.19,12.83 | 29.34,18.8 U5.5 29.61,21.52 | U14.57 57.86,39.62 58.61,39.29 60.2,39.29 60.83,39.62 C10.2 | 49.91,33.67 U14.38 49.93,30.99 v49.91,30.99 C11.2 | U14.26 41.87,38.62 C12.1 41.74,39.66 41.66,39.75 38.99,39.75 38.23,40.51 38.23,44.06 C18.1 R1.1 39.88,45.21 40.01,45.34 42.42,45.34 42.67,45.09 42.67,43.18 43.23,42.62 U14.18 | U15.5 18.14,58.67
  Top 0.305: v29.84,55.88 29.72,56.52 29.08,57.15 29.08,58.42 25.53,58.42 25.53,58.67 18.14,58.67 15.37,58.67 15.11,60.45 14.61,60.96 14.61,66.85 14.05,67.61 13.97,68.45 13.97,72.26 14.1,72.39 14.1,73.66 J7.2 14.25,73.69 15.65,75.11 LED1.A | v25.27,18.8 29.34,18.8 | 29.61,21.52 29.77,21.68 29.8,21.93 30.1,22.23
  Top 0.406: v29.08,27.56 29.59,28.07 30.61,28.07 | v30.23,39.12 v30.23,45.72 30.45,45.95 30.45,46.18 30.5,46.23 37.47,46.23 38.24,45.45 C18.1 | v29.84,55.88 45.85,55.88 46.36,56.39 v47.12,56.39 | J6.23 J6.26 | J6.29 J6.32 | J6.38 J6.35 | U11.2 37.39,28.19 40.62,28.19 42.67,26.19 46.33,26.19 47.3,25.27 v49.66,25.27 62.74,25.27 62.87,25.02 63.25,24.38 v64.9,24.38 | J6.41 J6.44 | J20.44 J20.41 | J20.38 J20.35 | J20.32 J20.29 | J20.17 J20.20 | J20.23 J20.26 | v64.64,37.21 64.64,38.48 61.72,38.48 61.72,39.62 C10.2 61.71,40.77 62.99,40.74 62.99,47.35 | R32.2 63.37,49.39 63.37,48.01 62.99,47.35 | 62.99,47.35 61.34,47.37 R33.2 R34.2 R2.2 | J6.17 J6.20
  Top 0.61: U11.4 31.06,24.89 30.98,24.64 C2.1 31.11,22.36 30.1,22.23 29.34,22.23 C25.1
  Top 1.016: U11.4 U11.2
  Bottom 0.254: v49.66,25.27 49.66,26.16 49.91,26.16 v49.91,30.99
  Bottom 0.305: v20.19,12.83 20.19,13.46 24.26,16.13 24.26,17.78 v25.27,18.8 | J8.9 83.95,23.24 82.93,24.26 65.15,24.26 v64.9,24.38
  Bottom 0.406: v30.23,39.12 32.13,35.69 32.13,31.37 v29.08,27.56 | v30.23,45.72 30.73,46.74 30.73,52.7 30.23,53.21 30.23,54.1 v29.84,55.88 | v47.12,56.39 47.12,71.12 | 47.12,71.12 J6.20 | 47.12,71.12 J6.23 | J6.26 J6.29 | J6.32 J6.35 | J6.38 J6.41 | v49.66,25.27 49.66,8.89 J20.26 J20.29 | J20.32 J20.35 | J20.38 J20.41 | J20.20 J20.23 | v64.64,37.21 64.64,25.4 64.9,25.02 v64.9,24.38
+5V/1  (via drill 0.8, 0.8 pad 1.27)
  Top 0.254: L1.2 27.09,56.73 27.05,56.77 26.8,56.77 24.89,58.17 14.61,58.17 14.35,60.33 13.84,60.33 13.84,60.35 13.46,60.73 13.46,62.57 R22.2
  Top 0.61: C23.1 27.17,51.96 27.17,52.65
  Top 1.27: C5.+ 26.29,40.89 28.07,37.08 37.47,37.08 v37.47,33.27
  Top 1.422: C5.+ 26.29,47.75 26.29,49.78 27.3,51.44 27.17,52.65 L1.2 32.26,53.34 32.26,53.09 37.72,53.09 37.72,53.34 v40.64,53.34
  Bottom 1.27: 40.77,33.15 37.59,33.27 v37.47,33.27
  Bottom 1.422: v40.64,53.34 40.77,54.61 41.02,55.12 40.89,57.17 40.77,66.57 J6.13 | 40.77,33.15 J20.15
+18V  (via drill 0.25)
  Top 0.254: 30.21,65.8 U3.6 29.07,67.83 | 18.86,68.58 18.16,68.58 18.14,68.56 U15.6 | 29.5,14.36 U5.6 | U4.6 19.19,5.07 19.19,4.86
  Top 0.305: 30.21,65.8 C7.1 | 22.36,66.66 21.46,67.31 19.95,67.31 C13.1 18.86,68.58 | 29.07,67.83 28.83,68.07 24,68.07 23.75,67.82 23.75,67.06 23.49,66.8 22.62,66.8 C6.+ | C16.1 29.5,14.36
  Top 0.406: C7.1 30.35,65.9 30.86,64.77 32.25,64.77 C8.+ 33.4,62.99 | C6.+ 22.36,66.66 | 15.62,5.08 15.51,4.32 C15.+ 15.76,5.08 | 11.56,14.81 D2.1 | U1.1 18.8,15.88 | C17.+ 24.4,11.57 | 35.43,30.63 U11.3 37.26,30.86
  Top 0.61: C14.1 19.19,4.86 19.18,5.08 15.76,5.08 | 15.62,5.08 13.34,5.08 11.56,6.86 11.56,14.81 | 18.8,15.88 21.21,13.46 22.36,13.46 C17.+ | 24.4,11.57 27.08,14.33 28.21,14.33 C16.1 | 35.43,30.63 v35.43,35.31 | v35.23,62.99 33.4,62.99
  Top 1.016: U2.1 13.84,44.58 13.84,40.89 21.97,38.99 24.38,38.48 C4.+ 24.57,35.43 | C24.1 33.66,33.28 33.66,31.11 | 26.54,35.31 26.16,35.43
  Top 1.27: 15.75,16 15.75,23.75 25.65,23.75 27.18,25.15 27.18,30.99 26.8,31.11 | 37.26,30.86 34.93,30.86 34.93,31.11 33.66,31.11 26.8,31.11 | 26.8,31.11 26.54,31.11 26.54,35.31 | 26.16,35.43 24.57,35.43
  Top 1.422: U1.1 15.75,16 16.1,16 16.1,15.85
  Top 1.676: D2.1 16.1,15.85
  Bottom 0.406: v35.43,35.31 35.26,35.33
  Bottom 0.61: 35.26,35.33 35.26,62.23 v35.23,62.99
  pour Top (isolate 0.254, no thermals): 18.03,69.37 18.11,67.39 18.11,67.31 18.39,67.34 18.39,65.48 18.03,65.46 18.29,65.2 18.75,65.2 18.87,65.33 18.87,66.37 19.43,66.93 21.21,66.93 21.59,66.55 21.59,65.3 21.72,65.18 23.06,65.18 23.24,65.35 23.95,65.74 24.13,65.91 24.13,67.59 28.85,67.36 29.11,66.62 29.11,64.85 30.38,64.85 30.89,64.34 32.21,64.34 32.64,63.91 32.64,62.43 32.94,62.13 33.76,62.13 34.14,62.51 34.14,65.15 31.57,69.29 24.84,69.29 23.04,67.92 21.87,67.92 21.72,67.77 20.17,67.77 19.91,68.02 19.91,69.09 19.61,69.39 18.06,69.39
  pour Top (no thermals): 18.82,5.69 18.82,2.97 19,2.79 19.61,2.79 19.68,2.87 19.68,3.66 20.19,4.19 20.19,5.56 20.09,5.74 18.87,5.74
  pour Top (no thermals): 27.66,15.29 27.66,13.82 27.76,13.72 29.51,13.72 29.64,13.84 29.64,15.16 29.49,15.32 27.69,15.32
CLK  (via drill 0.25)
  Top 0.254: v64.77,61.62 69.85,63.37 76.45,63.37 76.45,66.42 85.72,66.42 85.72,59.31 J11.3
  Top 0.305: J4.3 J11.3
  Bottom 0.254: v64.77,61.62 64.77,48.9 64.9,48.51 64.9,46.48 J3.11
DEBUG1  (via drill 0.25)
  Top 0.254: J8.1 83.95,10.92 72.9,10.92 71.63,12.19 67.56,12.19 63.88,15.88 56.01,15.88 55.12,16.76 55.12,19.05 52.45,21.72 46.99,21.72 v43.94,24.13 | v44.07,35.81 44.58,36.12 45.43,36.12 U14.31
  Bottom 0.254: v43.94,24.13 43.94,35.94 v44.07,35.81
DEBUG2  (via drill 0.25)
  Top 0.254: J8.2 67.82,12.7 64.13,16.38 56.64,16.38 55.63,17.53 55.63,19.3 52.71,22.23 47.88,22.23 v45.34,24.13 | v45.34,34.67 45.59,35.5 U14.32
  Bottom 0.254: v45.34,24.13 45.34,32.51 45.47,32.77 45.47,33.66 v45.34,34.67
DEBUG3  (via drill 0.25)
  Top 0.254: J8.3 83.95,14.86 82.91,13.97 80.49,13.97 80.16,13.82 67.44,13.84 64.39,16.89 60.33,16.89 v60.2,17.14 | v59.44,39.95 58.93,39.98 58.55,40.13 56.99,40.13 U14.58
  Bottom 0.254: v60.2,17.14 60.43,17.78 60.43,21.89 60.2,22.23 60.17,36.58 60.38,37.19 60.38,38.56 60.2,38.79 v59.44,39.95
DEBUG4  (via drill 0.25)
  Top 0.254: J8.4 80.52,15.24 79.63,14.35 67.69,14.35 64.52,17.58 v63.88,17.58 | v63.88,37.72 61.72,37.72 60.58,38.61 60.22,38.81 58.6,38.81 58.37,38.61 56.89,38.61 U14.55
  Bottom 0.254: v63.88,17.58 v63.88,37.72
DEBUG5  (via drill 0.25)
  Top 0.254: J8.5 82.8,16.51 80.64,16.51 78.84,14.99 67.94,14.99 64.52,18.29 59.94,18.29 v59.56,18.8 | v59.59,38.15 58.98,38.1 56.9,38.1 U14.54
  Bottom 0.254: v59.56,18.8 59.77,19.68 59.77,21.72 59.64,22.2 59.61,36.58 59.89,37.34 v59.59,38.15
DEBUG6  (via drill 0.25)
  Top 0.254: J8.6 81.15,17.78 78.28,15.49 68.2,15.49 64.9,18.8 63.88,18.8 v62.87,19.43 | v63.17,36.96 61.7,36.96 60.81,37.49 59.31,37.49 58.98,37.62 56.91,37.62 U14.53
  Bottom 0.254: v62.87,19.43 62.87,21.34 63.37,21.84 63.4,36.02 63.2,36.52 v63.17,36.96
DEBUG7  (via drill 0.25)
  Top 0.254: J8.7 83.95,20.19 82.8,19.05 80.52,19.05 77.6,16.13 68.33,16.13 64.31,20.14 64.11,20.32 59.31,20.32 v58.93,20.7 | v58.93,36.88 58.17,37.11 56.91,37.11 U14.52
  Bottom 0.254: v58.93,20.7 v58.93,36.88
DEBUG8  (via drill 0.25)
  Top 0.254: J8.8 79.76,20.32 77.34,17.91 77.34,17.27 76.83,16.76 68.45,16.76 67.37,17.84 67.37,18.59 v67.36,18.59 | v64.92,21.64 60.63,21.64 v56.26,21.97 | v56.52,34.16 56.52,35.26 U14.49
  Bottom 0.254: v56.26,21.97 56.26,23.5 56.52,23.62 v56.52,34.16 | v64.92,21.64 64.9,21.64 64.9,19.46 67.36,18.62 v67.36,18.59
FLOW_CTL_IN  (via drill 0.25 pad 0.61)
  Top 0.254: J13.2 85.72,42.16 85.72,31.11 80.14,31.11 79.38,30.99 79.38,28.07 77.47,28.07 v77.47,36.96
  Bottom 0.254: v77.47,36.96 67.56,36.96 J3.17
FLOW_CTL_OUT  (via drill 0.25 pad 0.61)
  Top 0.254: J13.1 85.22,39.62 85.22,32 84.84,31.75 78.36,31.75 v78.38,31.22
  Bottom 0.254: v78.38,31.22 78.38,30.68 77.04,29.34 67.06,29.34 J3.23
GND  (via drill 0.25, 0.25 pad 0.25, 0.5 pad 0.25, 0.8)
  Top 0.254: J3.2 68.71,59.82 | v64.21,41.12 64.82,41.1 | U5.2 31.11,17.28 31.11,17.27 v30.61,17.27 | U15.2 16.64,62.71 17.14,62.71 v17.14,62.99 | U3.2 27.56,62.71 28.07,62.71 v28.07,62.99
  Top 0.406: 37.22,23.62 36.27,23.62 36.15,23.75 v35.69,23.75
  Top 0.61: 5.56,51.64 9.53,51.63 D1.A | C23.2 29.58,47.75 v28.07,47.75 | C25.2 25.9,22.35 24.89,21.97 24,20.19 v22.99,20.19
  Top 1.016: v35.69,23.75 35.69,26.01 U11.1 | 10.41,48.39 10.54,48.39 U2.3 U2.6 | 10.41,48.39 6.98,48.39 | 6.98,48.39 7.24,48.01 7.11,47.75 7.11,47.31 U2.5 | 6.98,48.39 v5.71,48.77 | 10.41,48.39 v10.13,48.03 | C24.2 29.08,33.4 28.57,33.91 v28.57,34.16
  Top 1.27: 18.62,18.41 C1.C | v35.69,23.75 34.55,23.75 C2.2
  Top 1.422: D1.A v5.71,50.67 v5.71,48.77
  Top 1.778: C5.- 17.78,46.48 v16,46.48
  Top 2.54: U2.6 10.79,31.5 v10.67,27.05 14.41,27.05 C4.-
  Bottom 0.254: 63.86,41.73 v64.21,41.12
  Bottom 0.61: v28.07,47.75 28.45,48.13 | v22.99,20.19 22.73,20.57
  Bottom 1.016: v28.57,34.16 28.57,35.05
  other vias: 29.34,23.62 26.54,64.01 26.54,62.99 28.07,64.01 29.59,64.01 29.59,62.99 17.14,64.01 15.62,64.01 15.62,62.99 18.67,62.99 18.67,64.01 19.81,61.47 25.27,61.47 31.37,57.4 34.42,56.77 19.68,7.87 21.21,7.87 22.73,7.87 22.73,6.86 21.21,6.86 19.68,6.86 13.84,11.43 17.4,11.43 29.08,17.27 29.08,16.26 30.61,16.26 32.13,17.27 32.13,16.26 21.72,16.51 26.8,16.51 47.12,41.99 40.79,40.61 39.19,29.67 67.44,31.9 47.09,39.14 54.56,52.48
  pour Bottom: 0.48,0.66 0.66,78.41 85.9,78.03 85.72,0.51
  pour Top (rank 2): 0.64,78.23 0.64,0.64 15.37,0.64 85.34,0.76 84.96,78.11 20.57,78.23
  pour Top (no thermals): 26.29,64.26 29.84,64.26 29.84,64.01 29.84,62.74 26.29,62.74
  pour Top (no thermals): 15.37,64.26 18.92,64.26 18.92,64.01 18.92,62.74 15.37,62.74
  pour Top (no thermals): 19.43,8.13 22.99,8.13 22.99,7.87 22.99,6.6 19.43,6.6
  pour Top (no thermals): 28.83,17.53 32.39,17.53 32.39,16 28.83,16
  pour Top (no thermals): 8,51.44 11.05,51.44 11.05,48.39 8.13,48.39
GPIO-H1
  Top 0.254: J3.18 70.74,41.27 73.15,45.85 73.15,48.39 J16.5
GPIO-H2
  Top 0.254: J3.19 67.56,36.96 69.34,36.96 70.23,37.97 70.23,38.73 72.77,43.81 73.02,44.2 73.66,45.47 73.66,47.75 J16.6
GPIO-H3
  Top 0.254: J3.20 71.25,37.34 71.25,39.5 73.28,43.69 73.41,43.69 J16.7
GPIO-H4
  Top 0.254: J3.21 67.06,34.42 70.61,34.42 71.88,35.43 71.88,39.5 73.53,43.05 J16.8
GPIO-H5
  Top 0.254: J3.22 70.36,33.15 72.39,34.92 72.39,38.1 J16.9
GPIO-H7
  Top 0.254: J3.24 70.1,30.61 72.9,33.27 72.9,36.2 J16.10
GPIO-H8
  Top 0.254: J3.25 67.31,29.34 69.98,29.34 73.41,32.64 73.41,34.29 J16.11
GPIO-H9
  Top 0.254: J3.26 69.72,28.07 J16.12
GPIO-H10
  Top 0.254: J3.27 67.44,26.8 70.99,26.8 J16.13
GPIO-H11
  Top 0.254: J3.28 72.26,25.53 J16.14
GPIO-H12
  Top 0.254: J3.29 67.31,24.26 73.41,24.26 J16.15
GPIO-H13
  Top 0.254: J3.30 J16.16
GPIO-H14
  Top 0.254: J3.31 66.93,21.72 73.53,21.72 74.04,21.21 J16.17
GPIO-H15
  Top 0.254: J16.18 72.9,20.45 J3.32
HC_DIG_L1  (via drill 0.25)
  Top 0.254: v58.24,31.88 54.43,31.88 U14.47
  Bottom 0.254: 58.24,13.87 v58.24,31.88
  Bottom 0.305: J20.39 61.09,11.56 58.24,13.87
HC_DIG_L2  (via drill 0.25)
  Top 0.254: J20.42 63.63,13.08 62.61,14.1 56.01,14.1 v55.02,15.04 | v54.94,30.48 54.48,30.48 53.44,31.62 53.44,33.58 U14.45
  Bottom 0.254: v55.02,15.04 55.27,15.57 55.27,16.13 54.94,16.54 v54.94,30.48
HC_DIG_L3  (via drill 0.25)
  Top 0.254: J20.45 66.17,12.83 63.75,15.24 55.88,15.24 54.86,16.26 v52.83,16.26 | v52.96,30.35 52.96,31.75 52.43,32.26 52.43,33.65 U14.43
  Bottom 0.254: v52.83,16.26 52.88,29.31 v52.96,30.35
HC_DIG_R1  (via drill 0.25 pad 0.25)
  Top 0.254: v60.2,61.59 v57.4,61.59 | v54.89,38.86 54.94,38.68 54.94,35.23 U14.48
  Bottom 0.254: J6.37 61.09,68.33 60.2,67.44 v60.2,61.59 | v57.4,61.59 57.38,53.92 57.38,53.09 57.58,52.88 57.58,51.89 57.43,51.74 57.43,42.19 57.4,42.16 54.99,42.16 54.71,41.78 54.71,39.12 v54.89,38.86
HC_DIG_R2  (via drill 0.25 pad 0.25)
  Top 0.254: v61.21,60.58 v56.52,60.58 | v53.39,38.86 53.93,38.46 U14.46
  Bottom 0.254: J6.40 62.23,66.8 61.21,66.8 v61.21,60.58 | v56.52,60.58 56.52,58.29 56.13,58.17 56.13,45.59 53.72,45.59 53.72,40.41 v53.39,38.86
HC_DIG_R3  (via drill 0.25 pad 0.25)
  Top 0.254: v61.98,59.56 v55.63,59.56 | v52.4,39.14 52.42,38.05 53.34,37.9 53.47,37.62 53.47,35.31 52.93,34.92 U14.44
  Bottom 0.254: J6.43 66.17,67.18 64.26,67.18 62.87,66.29 61.98,66.29 v61.98,59.56 | v55.63,59.56 55.63,46.1 52.76,46.1 52.76,43.79 53.14,43.66 53.14,40.74 v52.4,39.14
HCA_L1  (via drill 0.25)
  Top 0.254: v55.42,40.13 54.74,40.13 54.61,40.39 48.51,40.39 48.26,40.51 47.12,40.51 46.74,40.13 45.48,40.13 U14.23
  Bottom 0.254: J20.33 56.01,20.95 55.5,21.46 55.5,23.5 56.01,24 56.01,33.33 55.7,33.6 55.7,35.28 56.01,35.59 56.01,40.13 v55.42,40.13
HCA_L2  (via drill 0.25)
  Top 0.254: v55.42,41.15 54.48,41.15 54.23,40.89 48.64,40.89 48.39,41.12 45.6,41.12 U14.21
  Bottom 0.254: 57.02,12.45 57.02,32.84 57.71,33.63 57.71,34.67 57.02,35.36 57.02,41.15 v55.42,41.15
  Bottom 0.305: J20.36 58.42,10.16 58.42,11.56 57.02,12.45
HCA_R1  (via drill 0.25 pad 0.25)
  Top 0.254: v46.25,63.91 46.61,63.63 53.62,63.63 53.62,68.43 J6.28 | v44.04,39.62 U14.24
  Bottom 0.254: v46.25,63.91 46.25,49.05 44.32,47.24 44.32,41.78 44.58,41.4 44.58,40.13 v44.04,39.62
HCA_R2  (via drill 0.25 pad 0.25)
  Top 0.254: v56.01,63.88 54.74,63.12 v45.47,63.12 | v43.82,40.64 44.47,40.62 U14.22
  Bottom 0.254: J6.31 v56.01,63.88 | v45.47,63.12 45.47,49.28 43.82,47.62 v43.82,40.64
HCA_R3  (via drill 0.25 pad 0.25)
  Top 0.254: v58.42,63.25 57.15,63.25 55.5,61.72 v44.7,61.72 | v43.18,37.85 43.59,38.12 43.73,38.12 43.94,38.12 U14.27
  Bottom 0.254: J6.34 58.55,63.37 v58.42,63.25 | v44.7,61.72 44.7,49.4 43.31,48.01 43.28,42.6 43.08,42.39 43.08,38.35 43.18,37.87 v43.18,37.85
ICSP_CLK  (via drill 0.25)
  Top 0.254: J7.5 21.87,73.69 23.24,75.06 49.53,75.06 v49.66,74.93 | v51.92,35.81 51.92,33.78 U14.42
  Bottom 0.254: v49.66,74.93 49.66,69.85 51.69,69.85 52.22,69.32 52.22,66.67 51.59,66.29 51.59,63.45 52.12,63.04 52.07,43.81 51.46,43.16 51.46,41.27 50.7,40.44 50.7,39.14 51.71,37.77 51.92,37.47 v51.92,35.81
ICSP_DATA  (via drill 0.25)
  Top 0.254: J7.4 19.2,73.81 21.72,76.02 v44.58,76 | v42.29,31.98 43.69,31.98 46.69,29.95 48.34,29.95 49.15,30.23 49.15,31.11 49.43,31.62 49.43,33.65 U14.37
  Bottom 0.254: v44.58,76 44.58,65.15 43.69,64.26 43.69,49.4 42.55,48.26 42.55,38.61 41.28,37.34 41.28,35.18 42.29,34.16 v42.29,31.98
LCA_L1  (via drill 0.25)
  Top 0.254: v46.3,14.99 47.35,14.99 47.98,14.61 51.26,14.61 51.89,14.48 v54.23,14.48 | v54.46,43.59 53.43,44.09 U14.4
  Bottom 0.254: J20.18 44.58,11.43 v46.3,14.99 | v54.23,14.48 54.23,14.35 54.2,42.14 v54.46,43.59
LCA_L2  (via drill 0.25)
  Top 0.254: v47.37,35.69 v49.91,35.69 | 49.93,43.69 U14.11
  Top 0.305: v49.91,43.69 49.93,43.69
  Bottom 0.254: J20.21 47.62,11.94 47.62,15.49 45.9,17.22 45.9,22.43 46.1,22.63 46.1,24.82 45.85,25.07 45.85,32.38 47.37,33.53 v47.37,35.69 | v49.91,35.69 49.91,37.59 49.02,38.73 49.02,42.04 49.91,43.1 v49.91,43.69
LCA_L3  (via drill 0.25)
  Top 0.254: 48.93,43.69 U14.13
  Top 0.305: v48.92,43.66 48.93,43.69
  Bottom 0.254: J20.24 48.39,26.04 49.02,26.67 48.77,38.23 48.51,38.61 48.51,42.16 48.92,43.08 v48.92,43.66
LCA_L4  (via drill 0.25)
  Top 0.254: v52.71,37.03 v47.93,37.03 | v47.93,43.69 U14.15
  Top 0.305: v47.93,43.69
  Bottom 0.254: J20.27 50.93,17.37 52.2,19.15 52.2,32.61 52.71,34.59 v52.71,37.03 | v47.93,37.03 v47.93,43.69
LCA_L5  (via drill 0.25)
  Top 0.254: v52.12,42.82 47.17,42.85 46.69,43.13 U14.17
  Bottom 0.254: J20.30 53.49,15.11 53.49,15.27 53.67,15.44 53.67,17.07 53.65,17.27 53.65,37.44 52.12,38.35 51.36,39.27 51.36,40.31 52.12,41.27 v52.12,42.82
LCA_R1  (via drill 0.25)
  Top 0.254: J6.16 47.07,64.36 v52.45,64.39 | v52.96,46.86 52.93,46.74 U14.5
  Bottom 0.254: v52.45,64.39 52.83,63.75 52.83,49.15 v52.96,46.86
LCA_R2  (via drill 0.25)
  Top 0.254: v49.4,46.74 49.43,46.99 U14.12 | J6.19 45.85,67.31 v49.53,67.31
  Bottom 0.254: v49.53,67.31 49.53,60.07 49.4,60.07 v49.4,46.74
LCA_R3  (via drill 0.25)
  Top 0.254: v48.39,48.39 48.43,48.39 U14.14
  Bottom 0.254: J6.22 v48.39,48.39
LCA_R4  (via drill 0.25)
  Top 0.254: v50.93,52.83 47.43,52.83 U14.16
  Bottom 0.254: J6.25 v50.93,52.83
LED  (via drill 0.25)
  Top 0.254: U14.28 46,37.62 v46.94,37.62 | v45.21,46.99 45.21,48.77 43.94,49.78 v32,49.78 | v24.51,64.39 v20.7,64.39 | v20.83,71.63 15.61,71.63 R19.2
  Bottom 0.254: v46.94,37.62 45.59,37.59 45.21,38.1 v45.21,46.99 | v32,49.78 32,53.21 30.73,54.48 30.73,56.13 29.97,57.02 29.34,56.9 26.92,59.31 26.67,59.69 26.67,60.2 26.04,60.71 24.51,60.71 v24.51,64.39 | v20.7,64.39 20.7,71.5 v20.83,71.63
LEGO_1A
  Top 0.254: U15.7 17.64,69.08 18.41,69.85 23.49,69.85 24.26,71.12 J2.1
LEGO_1B
  Top 0.254: U15.9 16.64,69.35 17.91,70.61 22.99,70.61
  Top 0.305: 22.99,70.61 23.24,70.87 23.24,72.14 24,72.9 24,73.41 24.51,73.66 J2.2
LEGO_2A  (via drill 0.25)
  Top 0.254: U3.7 28.57,66.79 v28.32,67.31
  Bottom 0.305: v28.32,67.31 28.57,68.33 28.57,70.61 J2.3
LEGO_2B  (via drill 0.25)
  Top 0.254: U3.9 27.56,66.8 27.56,67.05 v26.8,67.3
  Bottom 0.305: v26.8,67.3 26.8,72.4 J2.4
LEGO_4A  (via drill 0.25)
  Top 0.254: v30.1,12.95 U5.7
  Bottom 0.305: J1.4 28.07,10.67 v30.1,12.95
LEGO_4B
  Top 0.254: 31.11,12.7 U5.9
  Top 0.305: J1.3 29.34,6.35 29.34,10.92 31.11,12.7
LEGO_MOTOR_1A  (via drill 0.25)
  Top 0.254: U15.4 17.64,59.68 v17.4,59.44 | v19.05,59.44 19.68,59.18 v26.16,59.18 | v29.59,51.94 41.66,51.94 43.69,54.1 57.02,54.1 57.79,53.21 57.79,52.05 v58.29,51.54 | v58.29,43.48 58.06,43.48 57.76,43.18 57.65,43.1 U14.64
  Bottom 0.254: v17.4,59.44 18.29,59.56 18.67,59.44 v19.05,59.44 | v26.16,59.18 28.7,56.77 28.7,55.12 29.59,54.23 v29.59,51.94 | v58.29,51.54 v58.29,43.48
LEGO_MOTOR_1B  (via drill 0.25)
  Top 0.254: U15.3 17.14,60.2 16.76,59.94 16.38,59.94 v16.13,59.69 | v19.94,60.2 20.32,60.2 20.7,59.82 25.02,59.82 v25.27,59.94 | v29.59,50.8 41.4,50.8 44.2,53.59 56.01,53.59 v56.87,52.45 | v56.77,44.2 58.67,44.2 59.05,43.74 59.05,43.08 58.57,42.8 58.19,42.62 56.95,42.62 U14.63
  Bottom 0.254: v16.13,59.69 16.13,60.45 16.26,60.58 18.92,60.58 v19.94,60.2 | v25.27,59.94 25.27,59.05 28.07,56.39 28.07,54.99 28.7,54.36 28.7,51.56 v29.59,50.8 | v56.87,52.45 56.85,52.43 56.85,51.59 56.77,51.51 v56.77,44.2
LEGO_MOTOR_2A  (via drill 0.25)
  Top 0.254: U3.4 28.57,59.94 v28.32,59.18 | v31.5,54.99 32.39,54.99 32.64,55.24 v58.17,55.24 | v59.44,42.32 58.78,42.11 56.92,42.11 U14.62
  Bottom 0.254: v28.32,59.18 28.32,59.05 29.59,57.78 29.97,57.78 31.5,56.26 v31.5,54.99 | v58.17,55.24 58.17,52.96 58.95,51.94 58.95,51.23 58.85,50.88 58.85,49.66 58.83,43.99 v59.44,42.32
LEGO_MOTOR_2B  (via drill 0.25)
  Top 0.254: U3.3 28.07,60.2 27.94,60.07 27.56,59.94 v27.56,59.69 | v33.27,54.48 34.54,54.61 57.91,54.61 v59,53.21 | v60.33,43.31 60.05,41.78 59.79,41.63 56.91,41.63 U14.61
  Bottom 0.254: v27.56,59.69 27.56,60.45 27.69,60.58 28.19,60.58 29.72,59.31 29.72,58.55 31.88,58.55 32.77,57.78 32.77,54.99 v33.27,54.48 | v59,53.21 59,52.91 59.56,52.35 59.54,52.32 59.54,50.75 59.41,50.62 59.41,49.86 59.56,49.71 59.56,43.94 v60.33,43.31
LEGO_MOTOR_3A  (via drill 0.25)
  Top 0.254: U4.4 20.71,12.07 v20.95,12.32 | v39.4,26.7 41,26.7 42.11,25.63 46.05,25.63 47.75,23.88 v60.96,23.88 | v60.27,41.12 56.98,41.12 U14.60
  Bottom 0.254: v20.95,12.32 20.95,12.83 21.97,13.84 22.86,13.84 25.02,16 25.02,17.4 26.42,18.82 26.42,23.65 28.83,26.04 38.76,26.06 v39.4,26.7 | v60.96,23.88 60.96,33.02 60.68,33.83 60.68,36.5 60.88,37.06 60.88,39.29 60.68,39.7 60.33,40.26 v60.27,41.12
LEGO_MOTOR_3B  (via drill 0.25)
  Top 0.254: U4.3 21.21,11.18 v21.46,11.56 | v39.37,25.15 45.59,25.15 47.37,23.37 59.44,23.37 60.33,22.48 v62.61,22.48 | v62.18,41.78 61.54,41.78 60.66,40.46 59.94,40.46 59.69,40.62 56.9,40.62 U14.59
  Bottom 0.254: v21.46,11.56 21.97,12.19 21.97,12.83 22.35,13.21 22.99,13.21 25.65,15.88 25.65,17.27 27.03,18.57 27.03,23.52 29.08,25.53 38.99,25.53 v39.37,25.15 | v62.61,22.48 62.87,23.62 62.87,35.97 62.64,36.37 62.46,36.83 62.46,40.77 62.15,41.33 v62.18,41.78
LEGO_MOTOR_4A  (via drill 0.25)
  Top 0.254: U5.4 30.11,20.71 30.23,20.95 32.51,20.95 34.16,19.56 35.56,19.56 35.81,19.3 38.35,19.3 38.73,19.05 43.82,19.05 44.45,19.56 44.58,19.68 44.83,19.68 45.85,20.7 50.16,20.7 v50.67,20.95 | v50.14,42.16 52.45,42.16 52.86,42.42 52.86,43.69 52.43,43.94 52.43,45.05 U14.6
  Bottom 0.254: v50.67,20.95 50.62,37.54 49.58,38.84 49.58,40.84 50.14,41.58 v50.14,42.16
LEGO_MOTOR_4B  (via drill 0.25)
  Top 0.254: U5.3 30.61,20.45 32.26,20.45 33.91,19.05 35.31,19.05 35.56,18.8 38.1,18.8 38.48,18.54 44.45,18.54 45.47,19.43 46.1,20.07 46.36,20.19 50.93,20.19 v51.31,19.94 | v50.9,43.66 51.44,44.09 U14.8
  Bottom 0.254: v51.31,19.94 51.56,20.7 51.18,21.84 51.16,37.67 50.14,39.04 50.14,40.56 50.9,41.43 v50.9,43.66
MISO
  Top 0.305: J4.2 J11.2
  Bottom 0.254: J3.10 70.23,49.66 76.33,49.66 80.01,51.44 80.77,52.07 84.96,53.09 84.96,55.88 J11.2
MOSI  (via drill 0.25 pad 0.61)
  Top 0.254: J3.9 67.31,47.24 68.07,47.12 70.36,47.12 72.14,48.39 72.14,50.42 72.9,51.56 v72.9,52.2
  Top 0.305: J4.1 83.27,54.23 83.27,53.91 83.69,53.91 J11.1
  Bottom 0.254: v72.9,52.2 79.63,52.07 J11.1
N$1
  Top 1.016: U2.2 12.24,48.72 13.59,49.53 L1.1
  Top 2.54: D1.C 13.21,53.85 L1.1
N$3
  Top 0.254: U14.7 51.93,46.85 52.6,47.73 R3.1
N$5  (via drill 0.6)
  Top 0.305: 38.73,57.4 40.64,57.4 D6.2
  Top 0.406: 40.89,71.04 42.04,69.9 42.04,67.97 44.32,65.68 44.32,63.27 42.8,61.75 v42.8,59.94 42.8,59.89 42.8,57.4 | v38.73,59.94 38.73,57.4
  Bottom 0.305: J6.14 40.51,71.12
  Bottom 0.406: 40.51,71.12 39.5,70.1 39.5,60.71 v38.73,59.94 | v42.8,59.94 42.8,60.71 42.04,61.47 42.04,69.85 J6.14
N$6
  Top 0.305: D6.1 39.5,64.14 39.5,64.26 39.75,64.26
  Top 0.406: 39.5,64.26 39.5,69.85 J6.11 36.96,69.85 36.96,67.46 | 36.93,66.98 35.51,66.98 34.42,68.07 34.42,69.55 35.64,70.76 35.64,71.07 J6.8
  Top 1.016: 39.5,64.26 37.72,64.26 36.96,65.02 37.01,65.02 36.96,65.08 36.96,67.46
  Bottom 1.27: J6.2 J6.5 J6.8 J6.11
N$9
  Top 0.254: C19.2 R4.2
N$12
  Top 0.406: 39.5,11.94 39.5,8.89 J20.11 36.96,8.89 36.96,12.01 | 40.77,15.49 D4.1 | 36.88,12.62 36.04,12.62 34.42,11 34.42,8.89 35.36,7.92 35.38,7.92 J20.8
  Top 1.016: 39.5,11.94 40.51,11.94 40.77,12.32 40.77,15.49 | 36.96,12.01 36.96,15.49 40.26,15.49
  Bottom 1.27: J20.2 J20.5 J20.8 J20.11
N$18
  Top 0.254: U14.19 41.74,42.12 | 41.74,42.12 C9.1 | 41.74,42.12 41.74,43.99 R1.2
N$26
  Top 1.27: 3.43,15.39 4.37,15.39 D2.2
  Top 1.676: J5.1 4.47,64.39 1.47,64.39 1.5,16.18 1.65,15.41 3.43,15.39
N$31  (via drill 0.25)
  Top 0.254: U4.7 v20.7,3.05
  Bottom 0.305: v20.7,3.05 22.99,3.05 23.49,3.56 23.49,5.59 J1.2
N$32
  Top 0.254: U4.9 21.71,3.06 22.05,3.05 25.53,3.05
  Top 0.305: 25.53,3.05 J1.1
N$34  (via drill 0.25)
  Top 0.254: U2.4 8.89,44.59 v8.89,46.99 | v8.89,56.08 8.13,56.08 8.13,59.56 R23.2 R22.1
  Bottom 0.254: v8.89,46.99 v8.89,56.08
N$37
  Top 0.254: 50.43,48.89 U14.10
  Top 0.305: C3.2 50.43,48.89
N$39  (via drill 0.6 pad 0.25)
  Top 0.406: v44.5,14.4 43.94,13.84 43.92,13.84 43.33,13.28 42.04,12.01 42.04,8.64 41.22,7.82 40.97,7.82 J20.14
  Top 1.016: D4.2 43.94,21.84 44.32,21.46 44.32,21.21 v44.58,20.95 | v39.07,20.09 40.21,20.09 40.64,20.52 40.64,21.89
  Bottom 0.406: v39.07,20.09 39.5,19.56 39.5,8.51 40.51,7.62 J20.14 41.02,7.62 42.04,8.64 42.04,11.91 42.93,12.8 | 44.53,14.38 v44.5,14.4
  Bottom 1.016: v44.58,20.95 44.53,20.07 44.53,14.38 42.72,12.57 42.7,12.57
N$40
  Top 0.254: U9.7 U9.8 63.5,51.59 R32.1 C27.2
N$42
  Top 0.254: LED1.C 13.11,75.28 12.85,74.85 12.85,72.52 13.07,72.27 R19.1
RC_SERVO_1  (via drill 0.25)
  Top 0.254: v40.01,34.67 42.8,34.67 v43.13,34.42 | v43.16,29.82 43.16,29.29 45.06,28.17 46.69,28.17 47.9,26.8 50.93,26.8 U14.40
  Bottom 0.254: J6.1 30.61,66.67 32.39,66.67 32.39,64.52 35.94,64.52 35.94,53.85 37.21,53.85 37.21,34.67 v40.01,34.67 | v43.13,34.42 v43.16,29.82
RC_SERVO_2  (via drill 0.25)
  Top 0.254: v38.99,35.56 43.03,35.56 44.17,34.92 44.83,34.04 45.34,33.91 45.97,33.91 46.48,34.04 46.99,34.92 50.43,34.92 U14.39
  Bottom 0.254: J6.4 33.15,65.02 36.45,65.02 36.45,54.48 37.72,54.48 37.72,35.43 38.99,35.43 v38.99,35.56
RC_SERVO_3  (via drill 0.25)
  Top 0.254: v40.01,36.32 41.78,36.32 42.29,36.63 U14.30
  Bottom 0.254: J6.7 35.69,65.53 36.96,65.53 36.96,54.99 38.33,54.99 38.33,36.32 v40.01,36.32
RC_SERVO_4  (via drill 0.25)
  Top 0.254: v38.99,37.11 45.45,37.11 U14.29
  Bottom 0.254: J6.10 38.23,61.47 37.59,61.47 37.59,55.5 38.99,55.5 v38.99,37.11
RC_SERVO_5  (via drill 0.25)
  Top 0.254: v37.72,20.45 37.72,23.24 | v44.63,33.27 46.98,33.27 U14.33
  Top 0.305: 37.72,23.24 37.97,23.5 43.56,23.5 v44.7,22.61
  Bottom 0.254: J20.3 30.61,10.92 32.51,12.83 33.91,12.83 34.29,13.21 34.29,18.8 34.04,19.18 34.04,19.94 34.54,20.45 v37.72,20.45 | 44.63,22.86 v44.63,33.27
  Bottom 0.305: v44.7,22.61 44.63,22.86
RC_SERVO_6  (via drill 0.25)
  Top 0.254: v35.05,18.29 37.59,18.29 37.97,18.03 45.34,18.03 45.47,18.41 v46.63,19.41 | v46.61,32 47.93,32.51 U14.34
  Bottom 0.254: J20.6 33.15,12.06 35.05,12.06 v35.05,18.29 | v46.63,19.41 46.61,19.94 46.61,25.53 46.36,25.78 46.36,31.42 46.61,31.67 v46.61,32
RC_SERVO_7  (via drill 0.25)
  Top 0.254: v35.81,17.53 47.12,17.53 v47.12,18.03 | v47.12,31.19 47.52,31.45 48.43,32 U14.35
  Bottom 0.254: J20.9 35.81,10.16 v35.81,17.53 | v47.12,18.03 47.14,18.06 47.37,18.57 47.37,20.78 47.12,21.01 v47.12,31.19
RC_SERVO_8  (via drill 0.25)
  Top 0.254: v37.72,16.76 v47.62,16.76 | v47.88,30.61 48.93,31.75 U14.36
  Bottom 0.254: v47.62,16.76 47.88,17.65 v47.88,30.61
  Bottom 0.305: J20.12 38.23,11.3 37.72,11.81 v37.72,16.76
RX0
  Top 0.254: J14.4 82.8,34.04 82.8,37.08 81.53,37.59 81.53,44.07 78.36,45.97 78.36,55.37 76.45,57.4 70.36,57.4 69.72,56.9 J3.4
RX1  (via drill 0.25 pad 0.61)
  Top 0.254: v71.37,48.9 71.37,49.66 70.1,50.93 70.1,52.96 69.6,53.47 J3.6
  Bottom 0.254: J12.4 82.55,49.53 79.88,49.53 77.85,48.13 76.58,47.24 71.5,47.24 71.37,47.37 v71.37,48.9
SCL  (via drill 0.25, 0.25 pad 0.25)
  Top 0.254: 61.21,49.92 R33.1 61.21,49.16 61.21,49.92 | 61.21,49.92 v61.21,50.16 61.21,50.67 60.5,50.83 U9.6 60.58,51.59 v60.58,52.96 | J20.50 J20.47 | v62.18,35.18 59.05,35.18 57.79,36.12 U14.50
  Top 0.406: J6.50 J6.47
  Bottom 0.254: v60.58,52.96 60.05,53.57 59.26,53.85 58.85,55.07 58.85,58.42 59.05,58.62 62,58.62 62.71,58.95 62.74,65.79 63.75,65.79 64.77,66.55 69.98,66.55 69.98,71.12 J6.50 | v61.21,50.16 61.47,50.16 61.47,41.27 61.95,40.62 61.95,36.73 62.23,35.92 v62.18,35.18 62.36,34.54 62.36,23.88 61.85,22.86 61.85,21.46 61.47,21.08 61.47,13.46 69.98,13.46 69.98,7.62 J20.47
SCL_BFIN  (via drill 0.25)
  Top 0.254: v60.76,54.63 60.71,54.71 60.5,55.09 U9.3
  Bottom 0.254: J3.14 68.6,43.31 67.23,41.94 65,41.94 63.96,42.47 63.96,45.39 63.7,45.67 63.7,53.29 61.42,54.33 v60.76,54.63
SDA  (via drill 0.25)
  Top 0.254: 59.82,49.92 R34.1 59.82,49.16 59.82,49.92 | 59.82,49.92 v60.17,50.16 59.84,50.67 U9.5 59.82,51.59 v59.82,54.51 | J20.51 J20.48 | v61.34,35.89 58.95,35.89 57.86,36.63 U14.51
  Top 0.406: J6.49 J6.46
  Bottom 0.254: v59.82,54.51 59.82,54.89 59.36,55.35 59.39,57.73 59.72,58.06 63.25,58.06 63.25,65.28 64.13,65.28 65.28,66.04 71.25,66.04 J6.49 | v60.17,50.16 60.33,49.91 60.33,44.58 60.83,44.58 60.96,44.2 60.98,43.71 60.98,40.77 61.39,40.34 61.39,36.58 v61.34,35.89 61.37,33.91 61.85,33.2 61.85,24 61.34,23.11 61.34,21.84 60.94,21.34 60.94,12.7 68.71,12.7 J20.48
SDA_BFIN  (via drill 0.25)
  Top 0.254: U9.4 59.84,57.15 v60.07,57.38 | v65.07,44.68 65.07,44.63 64.31,43.87 64.31,42.62 J3.15
  Bottom 0.254: v60.07,57.38 63.83,57.38 64.26,56.92 64.29,46 65.1,45.21 v65.07,44.68
SPI_SEL
  Top 0.254: J3.12 70.61,45.85 72.64,47.24 72.64,49.4 73.66,50.93 73.66,52.7 J16.4
  Bottom 0.254: J16.4 77.6,53.47 77.6,60.71 82.17,60.71 82.17,61.72 J11.4
SPI_SEL2
  Bottom 0.254: J4.4 77.49,61.85 76.89,61.24 76.89,55.52 76.02,54.66 73.71,54.66 70.38,51.33 70.38,50.62 69.55,49.78 69.52,49.78 69.44,49.71 68,49.71 67.41,49.12 67.41,44.55 J3.13
TMR2
  Bottom 0.254: J3.7 67.44,52.2 69.47,52.2 72.39,55.12 72.39,58.42 73.02,58.93 73.02,60.83 73.41,61.21 J16.1
TMR3
  Bottom 0.254: J3.8 69.72,51.56 72.01,53.85 73.02,54.74 73.02,57.66 74.04,58.67 J16.2
TX0
  Top 0.254: J14.3 80.26,33.02 79.63,33.78 79.63,44.07 77.85,45.09 77.85,54.74 67.56,54.74 J3.3
TX1  (via drill 0.25 pad 0.61)
  Top 0.254: J3.5 67.44,52.2 67.44,49.78 67.56,49.66 70.1,49.66 70.36,49.4 v70.36,48.26
  Bottom 0.254: v70.36,48.26 70.36,46.99 73.48,44.58 75.84,44.58 76,44.63 76.71,45.21 78.61,46.74 J12.3

### Text on the board
tPlace: I2C | C | D | 5 | 6 | 7 | 8 | E | 16 | 17 | 18 | 19 | 20 | 21 | 22 | 26 | 27 | 28 | GND | SCL | ICSP | SDA | SERVO | Analog/DigitalIO | I2C | SPI2 | SPI1 | 1 | J3 | - | + | PWR IN | UART1 | FLOW | RCMX1 | UART0 | PWR | 32 | DEBUG | I2C | SERVO | Analog/Digital IO | SDA | SCL | GND | I2C | A | B | 1 | 2 | 3 | 4 | E | 9 | 10 | 11 | 12 | 13 | 14 | 15 | 23 | 24 | 25